# EAGLE design MiSTer Vector 2.0 (EAGLE 9.0.1)
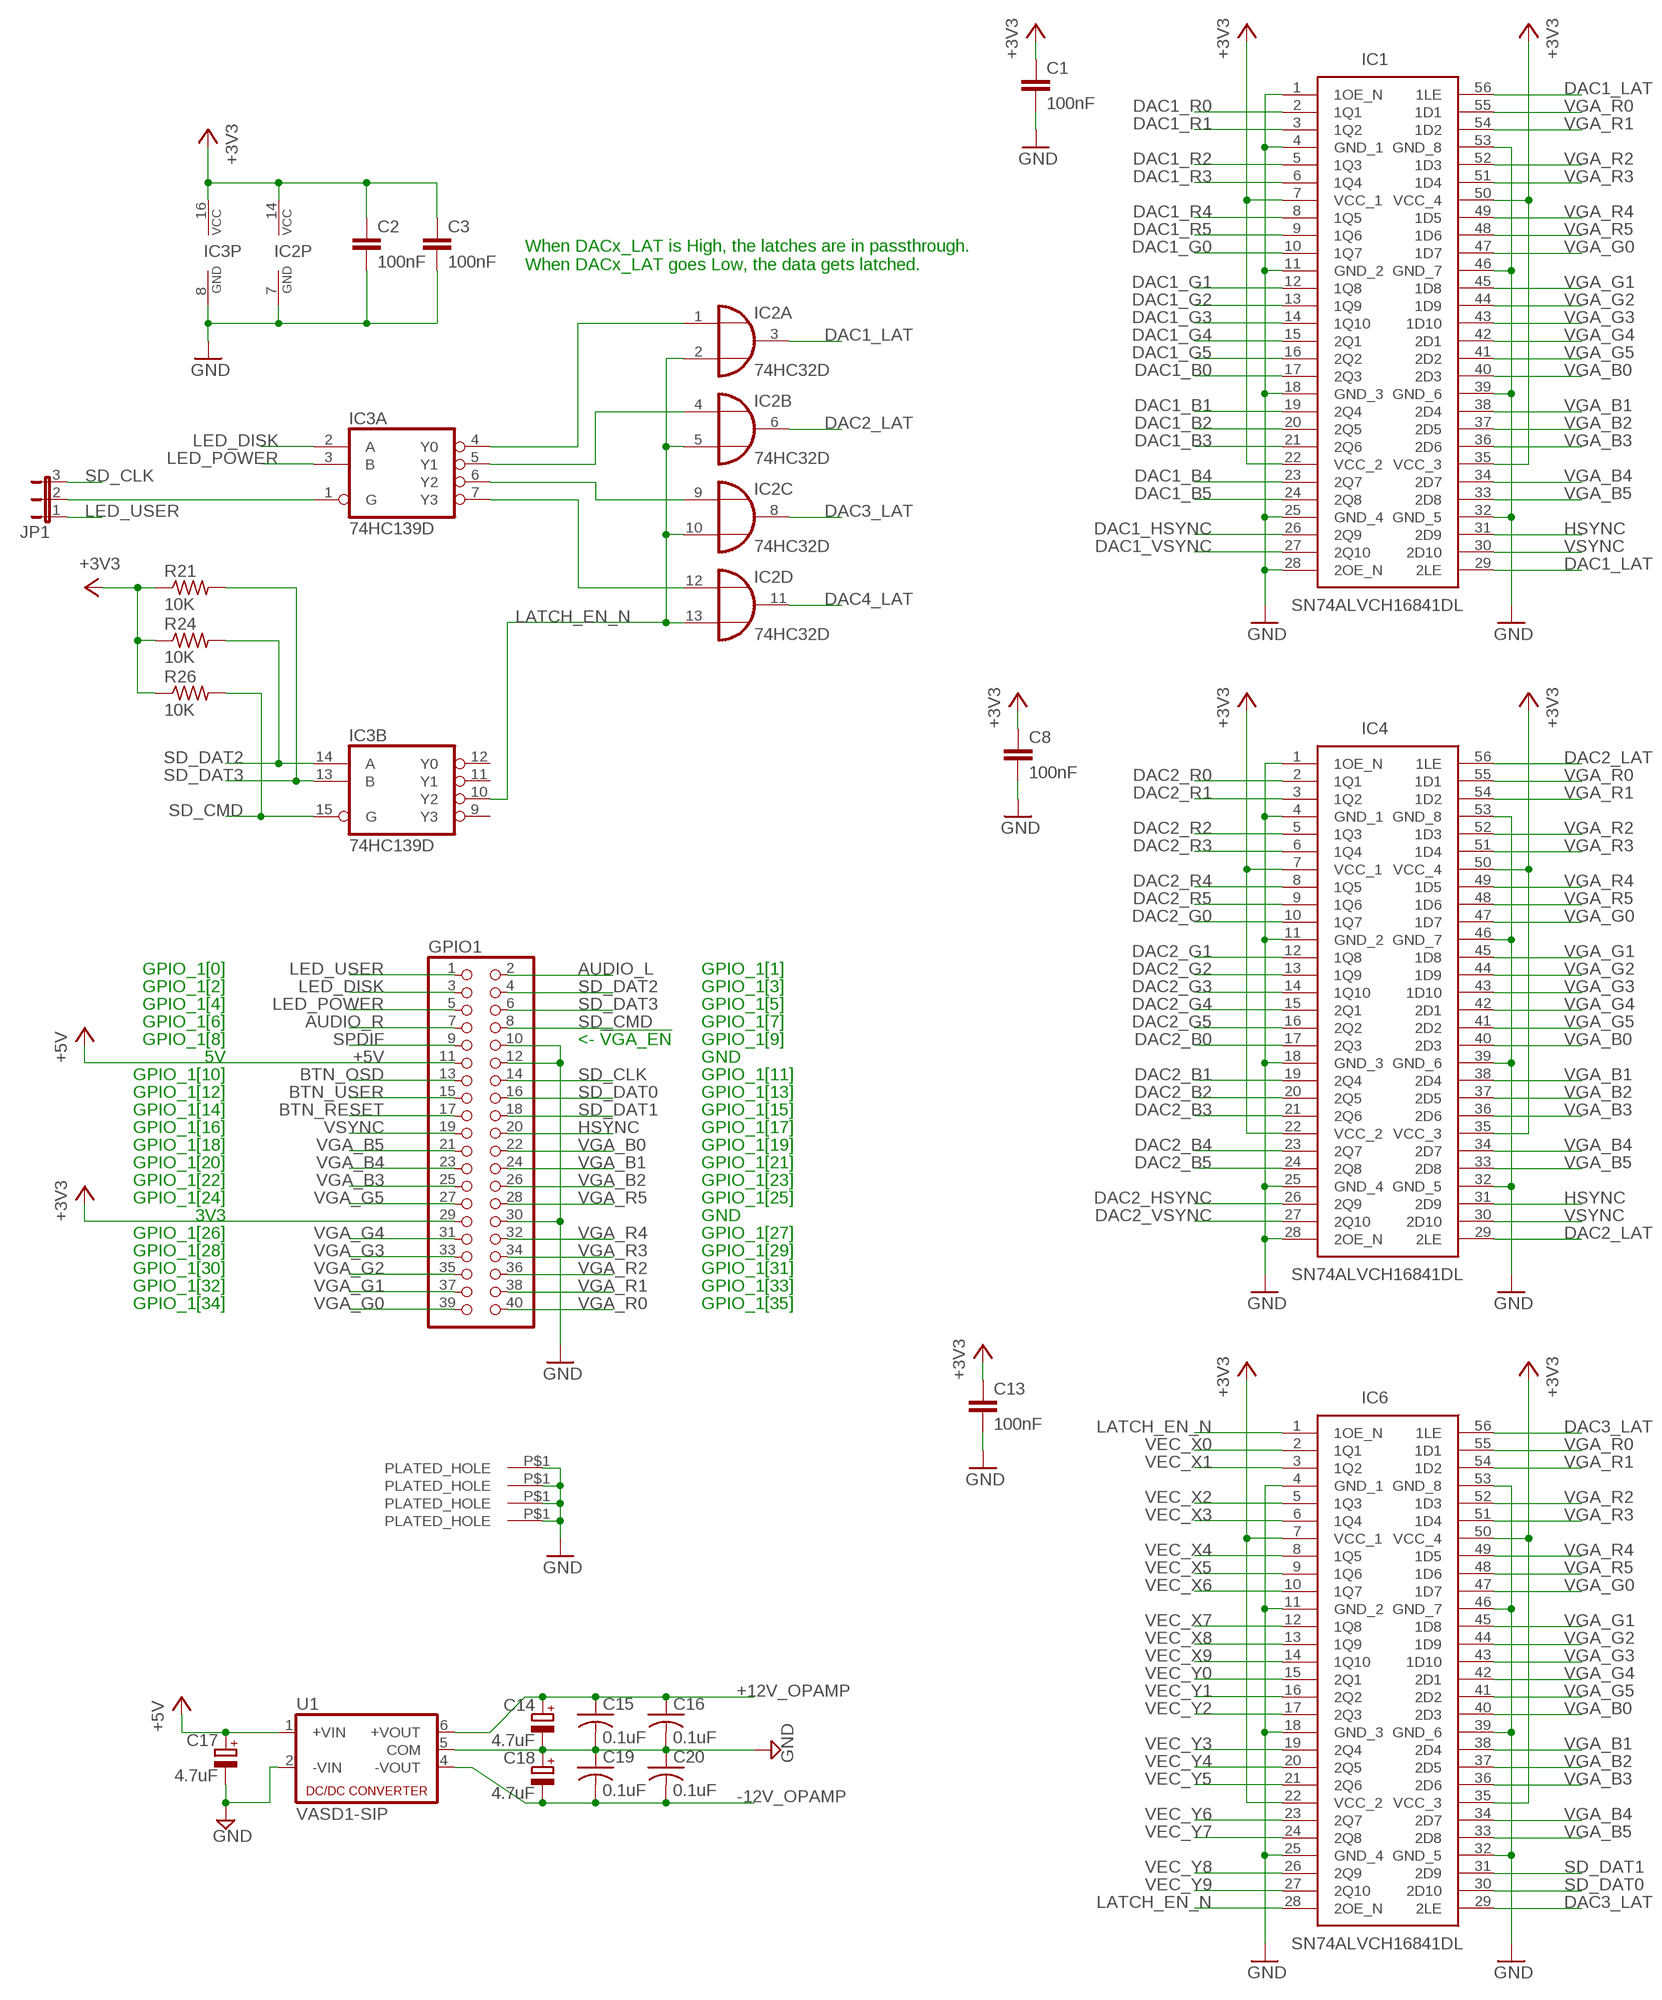
[diagram p0: schematic, sheet 1, part 1 of 2]
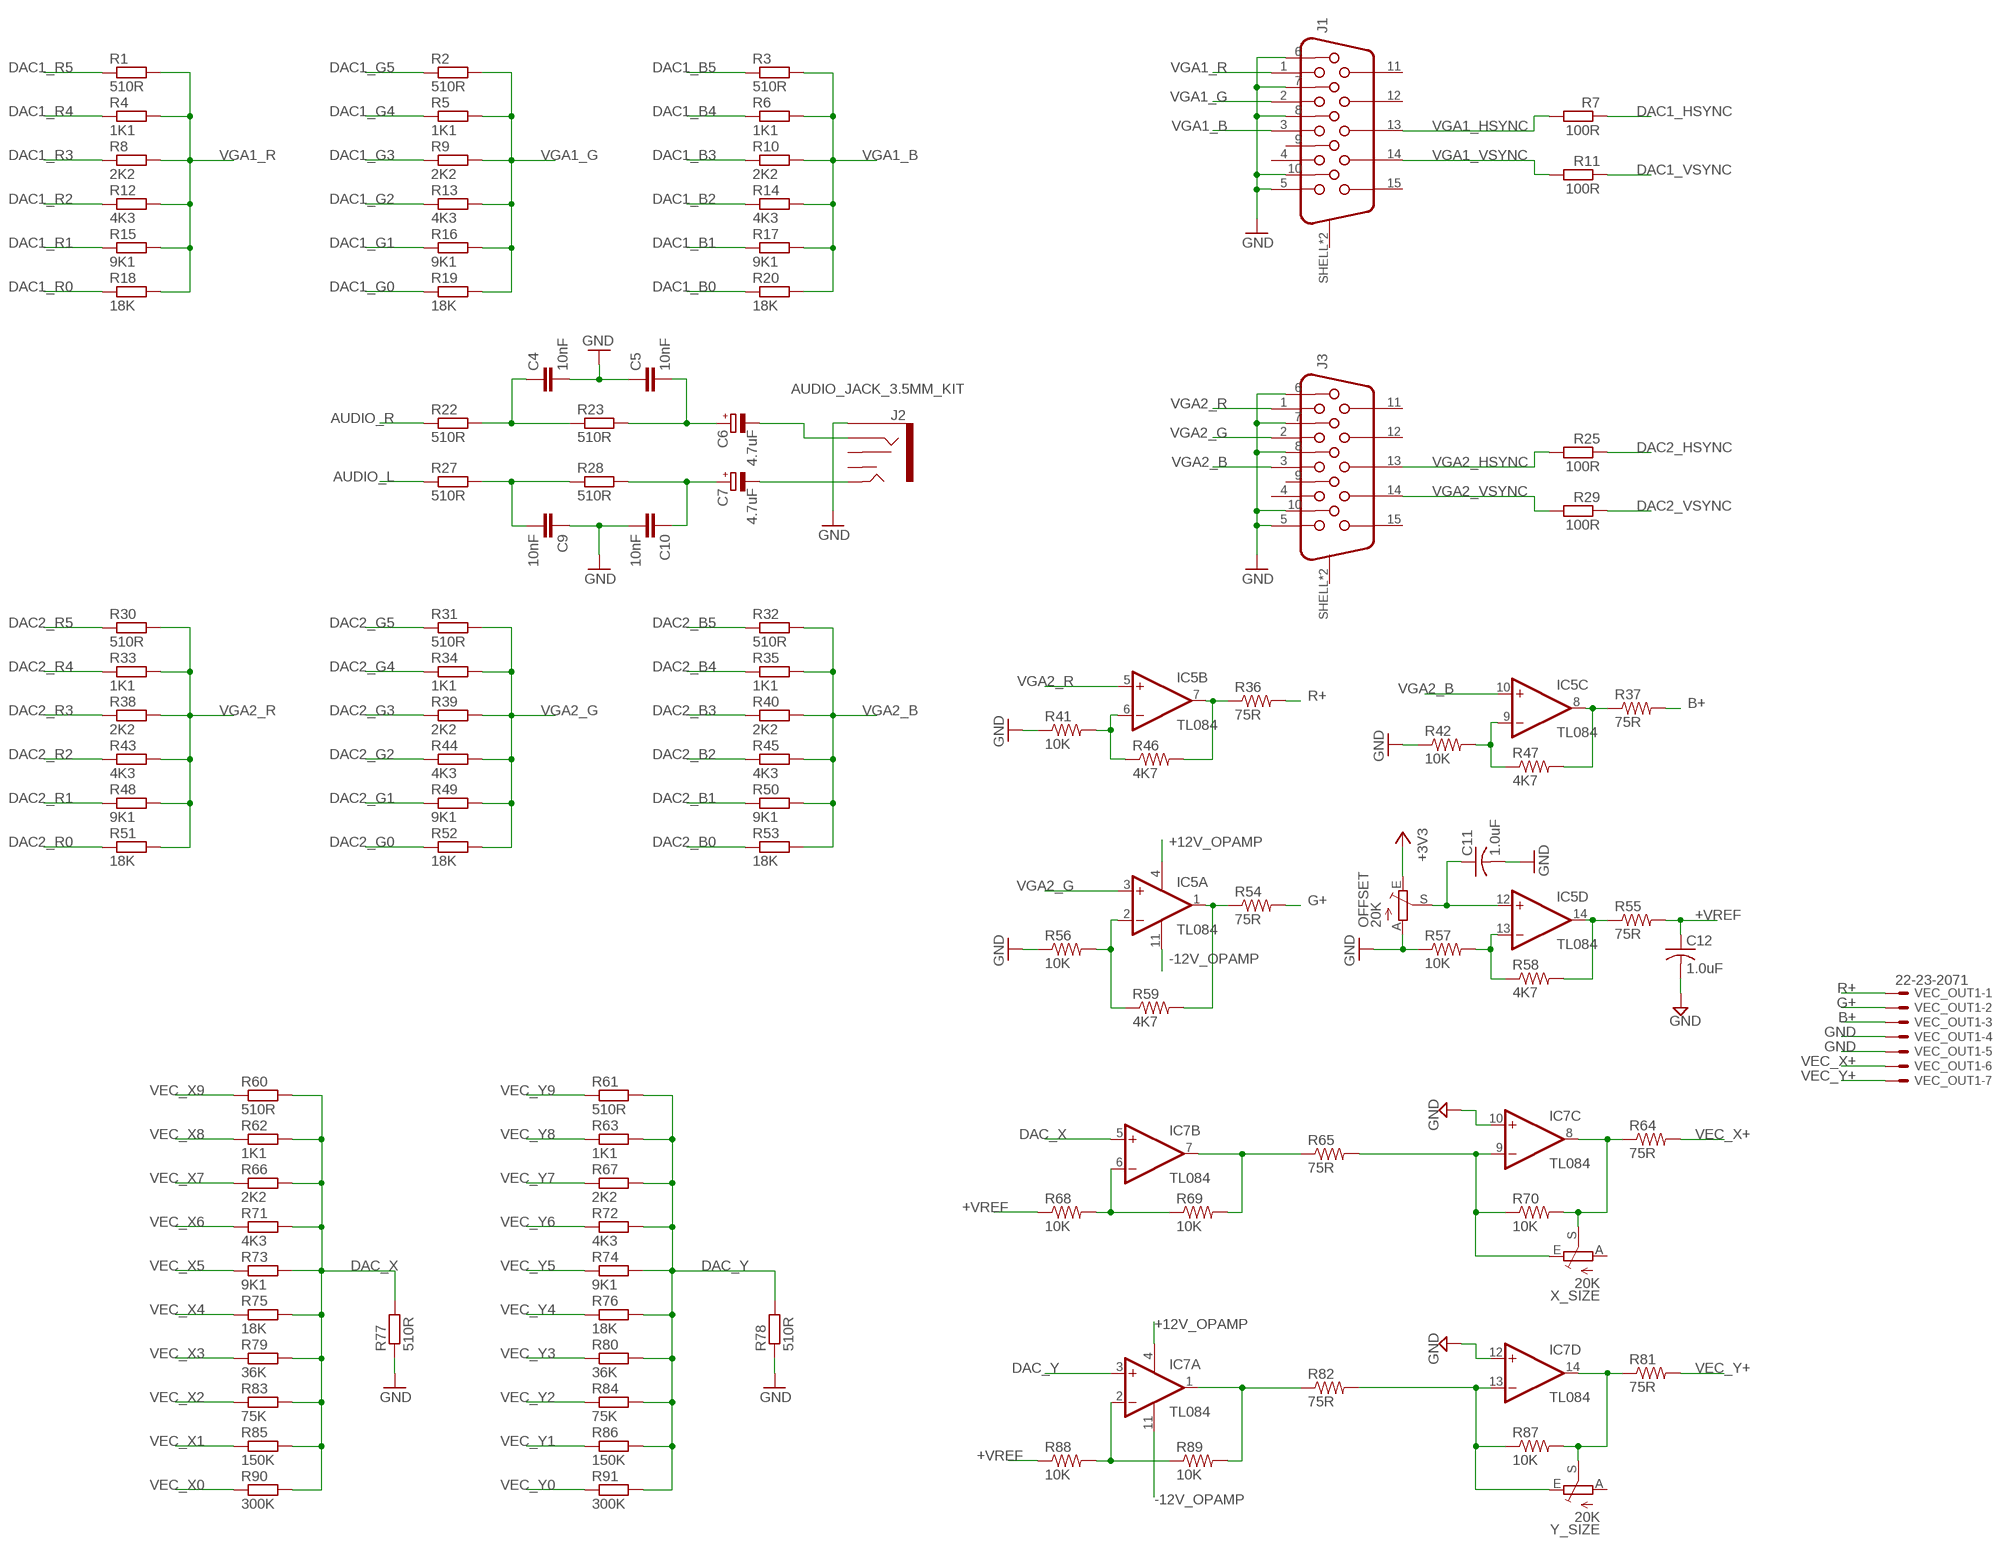
[diagram p1: schematic, sheet 1, part 2 of 2]

## Parts
C1  100nF  C-EUC0603  [C0603]
C2  100nF  C-EUC0603  [C0603]
C3  100nF  C-EUC0603  [C0603]
C4  10nF  C-EUC0603  [C0603]
C5  10nF  C-EUC0603  [C0603]
C6  4.7uF  CPOL-EUCT3528  [CT3528]
C7  4.7uF  CPOL-EUCT3528  [CT3528]
C8  100nF  C-EUC0603  [C0603]
C9  10nF  C-EUC0603  [C0603]
C10  10nF  C-EUC0603  [C0603]
C11  1.0uF  C-USC0603  [C0603]
C12  1.0uF  C-USC0603  [C0603]
C13  100nF  C-EUC0603  [C0603]
C14  4.7uF  CPOL-EUCT3528  [CT3528]
C15  0.1uF  C-USC0603  [C0603]
C16  0.1uF  C-USC0603  [C0603]
C17  4.7uF  CPOL-EUCT3528  [CT3528]
C18  4.7uF  CPOL-EUCT3528  [CT3528]
C19  0.1uF  C-USC0603  [C0603]
C20  0.1uF  C-USC0603  [C0603]
GPIO1  PINHD-2X20  [2X20]
IC1  SN74ALVCH16841DL  [SOP50P810X120-56N]
IC2  74HC32D  [SO14]
IC3  74HC139D  [SO16]
IC4  SN74ALVCH16841DL  [SOP50P810X120-56N]
IC5  TL084  [SOIC-14]
IC6  SN74ALVCH16841DL  [SOP50P810X120-56N]
IC7  TL084  [SOIC-14]
J1  618015330923  [618015330923]
J2  AUDIO_JACK_3.5MM_KIT  [AUDIO-JACK-KIT]
J3  618015330923  [618015330923]
JP1  JP2E  [JP2]
OFFSET  20K  TRIM_EU-B25P  [B25P]
R1  510R  R-EU_R0603  [R0603]
R2  510R  R-EU_R0603  [R0603]
R3  510R  R-EU_R0603  [R0603]
R4  1K1  R-EU_R0603  [R0603]
R5  1K1  R-EU_R0603  [R0603]
R6  1K1  R-EU_R0603  [R0603]
R7  100R  R-EU_R0603  [R0603]
R8  2K2  R-EU_R0603  [R0603]
R9  2K2  R-EU_R0603  [R0603]
R10  2K2  R-EU_R0603  [R0603]
R11  100R  R-EU_R0603  [R0603]
R12  4K3  R-EU_R0603  [R0603]
R13  4K3  R-EU_R0603  [R0603]
R14  4K3  R-EU_R0603  [R0603]
R15  9K1  R-EU_R0603  [R0603]
R16  9K1  R-EU_R0603  [R0603]
R17  9K1  R-EU_R0603  [R0603]
R18  18K  R-EU_R0603  [R0603]
R19  18K  R-EU_R0603  [R0603]
R20  18K  R-EU_R0603  [R0603]
R21  10K  R-US_R0603  [R0603]
R22  510R  R-EU_R0603  [R0603]
R23  510R  R-EU_R0603  [R0603]
R24  10K  R-US_R0603  [R0603]
R25  100R  R-EU_R0603  [R0603]
R26  10K  R-US_R0603  [R0603]
R27  510R  R-EU_R0603  [R0603]
R28  510R  R-EU_R0603  [R0603]
R29  100R  R-EU_R0603  [R0603]
R30  510R  R-EU_R0603  [R0603]
R31  510R  R-EU_R0603  [R0603]
R32  510R  R-EU_R0603  [R0603]
R33  1K1  R-EU_R0603  [R0603]
R34  1K1  R-EU_R0603  [R0603]
R35  1K1  R-EU_R0603  [R0603]
R36  75R  R-US_R0603  [R0603]
R37  75R  R-US_R0603  [R0603]
R38  2K2  R-EU_R0603  [R0603]
R39  2K2  R-EU_R0603  [R0603]
R40  2K2  R-EU_R0603  [R0603]
R41  10K  R-US_R0603  [R0603]
R42  10K  R-US_R0603  [R0603]
R43  4K3  R-EU_R0603  [R0603]
R44  4K3  R-EU_R0603  [R0603]
R45  4K3  R-EU_R0603  [R0603]
R46  4K7  R-US_R0603  [R0603]
R47  4K7  R-US_R0603  [R0603]
R48  9K1  R-EU_R0603  [R0603]
R49  9K1  R-EU_R0603  [R0603]
R50  9K1  R-EU_R0603  [R0603]
R51  18K  R-EU_R0603  [R0603]
R52  18K  R-EU_R0603  [R0603]
R53  18K  R-EU_R0603  [R0603]
R54  75R  R-US_R0603  [R0603]
R55  75R  R-US_R0603  [R0603]
R56  10K  R-US_R0603  [R0603]
R57  10K  R-US_R0603  [R0603]
R58  4K7  R-US_R0603  [R0603]
R59  4K7  R-US_R0603  [R0603]
R60  510R  R-EU_R0603  [R0603]
R61  510R  R-EU_R0603  [R0603]
R62  1K1  R-EU_R0603  [R0603]
R63  1K1  R-EU_R0603  [R0603]
R64  75R  R-US_R0603  [R0603]
R65  75R  R-US_R0603  [R0603]
R66  2K2  R-EU_R0603  [R0603]
R67  2K2  R-EU_R0603  [R0603]
R68  10K  R-US_R0603  [R0603]
R69  10K  R-US_R0603  [R0603]
R70  10K  R-US_R0603  [R0603]
R71  4K3  R-EU_R0603  [R0603]
R72  4K3  R-EU_R0603  [R0603]
R73  9K1  R-EU_R0603  [R0603]
R74  9K1  R-EU_R0603  [R0603]
R75  18K  R-EU_R0603  [R0603]
R76  18K  R-EU_R0603  [R0603]
R77  510R  R-EU_R0603  [R0603]
R78  510R  R-EU_R0603  [R0603]
R79  36K  R-EU_R0603  [R0603]
R80  36K  R-EU_R0603  [R0603]
R81  75R  R-US_R0603  [R0603]
R82  75R  R-US_R0603  [R0603]
R83  75K  R-EU_R0603  [R0603]
R84  75K  R-EU_R0603  [R0603]
R85  150K  R-EU_R0603  [R0603]
R86  150K  R-EU_R0603  [R0603]
R87  10K  R-US_R0603  [R0603]
R88  10K  R-US_R0603  [R0603]
R89  10K  R-US_R0603  [R0603]
R90  300K  R-EU_R0603  [R0603]
R91  300K  R-EU_R0603  [R0603]
U1  VASD1-SIP  NMA  [NMA]
U$1  PLATED_HOLE3.6MM  [PLATED_HOLE_3.6MM]
U$2  PLATED_HOLE3.6MM  [PLATED_HOLE_3.6MM]
U$3  PLATED_HOLE3.6MM  [PLATED_HOLE_3.6MM]
U$4  PLATED_HOLE3.6MM  [PLATED_HOLE_3.6MM]
VEC_OUT1  22-23-2071  [22-23-2071]
X_SIZE  20K  TRIM_EU-B25P  [B25P]
Y_SIZE  20K  TRIM_EU-B25P  [B25P]

## Nets
+3V3: C1.1 C2.1 C3.1 C8.1 C13.1 GPIO1.29 IC1.7(VCC_1) IC1.22(VCC_2) IC1.35(VCC_3) IC1.50(VCC_4) IC2.14(P:VCC) IC3.16(P:VCC) IC4.7(VCC_1) IC4.22(VCC_2) IC4.35(VCC_3) IC4.50(VCC_4) IC6.7(VCC_1) IC6.22(VCC_2) IC6.35(VCC_3) IC6.50(VCC_4) OFFSET.E R21.1 R24.1 R26.1
+5V: C17.+ GPIO1.11 U1.1(+VIN)
+12V_OPAMP: C14.+ C15.1 C16.1 IC5.4(A:V+) IC7.4(A:V+) U1.6(+VOUT)
+VREF: C12.1 R55.2 R68.1 R88.1
-12V_OPAMP: C18.- C19.2 C20.2 IC5.11(A:V-) IC7.11(A:V-) U1.4(-VOUT)
AUDIO_L: GPIO1.2 R27.1
AUDIO_R: GPIO1.7 R22.1
B1+: IC5.8(C:OUT) R37.1 R47.2
B+: R37.2 VEC_OUT1.3
BTN_OSD: GPIO1.13
BTN_RESET: GPIO1.17
BTN_USER: GPIO1.15
DAC1_B0: IC1.17(2Q3) R20.1
DAC1_B1: IC1.19(2Q4) R17.1
DAC1_B2: IC1.20(2Q5) R14.1
DAC1_B3: IC1.21(2Q6) R10.1
DAC1_B4: IC1.23(2Q7) R6.1
DAC1_B5: IC1.24(2Q8) R3.1
DAC1_G0: IC1.10(1Q7) R19.1
DAC1_G1: IC1.12(1Q8) R16.1
DAC1_G2: IC1.13(1Q9) R13.1
DAC1_G3: IC1.14(1Q10) R9.1
DAC1_G4: IC1.15(2Q1) R5.1
DAC1_G5: IC1.16(2Q2) R2.1
DAC1_HSYNC: IC1.26(2Q9) R7.1
DAC1_LAT: IC1.29(2LE) IC1.56(1LE) IC2.3(A:O)
DAC1_R0: IC1.2(1Q1) R18.1
DAC1_R1: IC1.3(1Q2) R15.1
DAC1_R2: IC1.5(1Q3) R12.1
DAC1_R3: IC1.6(1Q4) R8.1
DAC1_R4: IC1.8(1Q5) R4.1
DAC1_R5: IC1.9(1Q6) R1.1
DAC1_VSYNC: IC1.27(2Q10) R11.1
DAC2_B0: IC4.17(2Q3) R53.1
DAC2_B1: IC4.19(2Q4) R50.1
DAC2_B2: IC4.20(2Q5) R45.1
DAC2_B3: IC4.21(2Q6) R40.1
DAC2_B4: IC4.23(2Q7) R35.1
DAC2_B5: IC4.24(2Q8) R32.1
DAC2_G0: IC4.10(1Q7) R52.1
DAC2_G1: IC4.12(1Q8) R49.1
DAC2_G2: IC4.13(1Q9) R44.1
DAC2_G3: IC4.14(1Q10) R39.1
DAC2_G4: IC4.15(2Q1) R34.1
DAC2_G5: IC4.16(2Q2) R31.1
DAC2_HSYNC: IC4.26(2Q9) R25.1
DAC2_LAT: IC2.6(B:O) IC4.29(2LE) IC4.56(1LE)
DAC2_R0: IC4.2(1Q1) R51.1
DAC2_R1: IC4.3(1Q2) R48.1
DAC2_R2: IC4.5(1Q3) R43.1
DAC2_R3: IC4.6(1Q4) R38.1
DAC2_R4: IC4.8(1Q5) R33.1
DAC2_R5: IC4.9(1Q6) R30.1
DAC2_VSYNC: IC4.27(2Q10) R29.1
DAC3_LAT: IC2.8(C:O) IC6.29(2LE) IC6.56(1LE)
DAC4_LAT: IC2.11(D:O)
DAC_X: IC7.5(B:+IN) R60.2 R62.2 R66.2 R71.2 R73.2 R75.2 R77.2 R79.2 R83.2 R85.2 R90.2
DAC_Y: IC7.3(A:+IN) R61.2 R63.2 R67.2 R72.2 R74.2 R76.2 R78.2 R80.2 R84.2 R86.2 R91.2
G1+: IC5.1(A:OUT) R54.1 R59.2
G+: R54.2 VEC_OUT1.2
GND: C1.2 C2.2 C3.2 C4.2 C5.1 C8.2 C9.1 C10.2 C11.2 C12.2 C13.2 C14.- C15.2 C16.2 C17.- C18.+ C19.1 C20.1 GPIO1.10 GPIO1.12 GPIO1.30 IC1.1(1OE_N) IC1.4(GND_1) IC1.11(GND_2) IC1.18(GND_3) IC1.25(GND_4) IC1.28(2OE_N) IC1.32(GND_5) IC1.39(GND_6) IC1.46(GND_7) IC1.53(GND_8) IC2.7(P:GND) IC3.8(P:GND) IC4.1(1OE_N) IC4.4(GND_1) IC4.11(GND_2) IC4.18(GND_3) IC4.25(GND_4) IC4.28(2OE_N) IC4.32(GND_5) IC4.39(GND_6) IC4.46(GND_7) IC4.53(GND_8) IC6.4(GND_1) IC6.11(GND_2) IC6.18(GND_3) IC6.25(GND_4) IC6.32(GND_5) IC6.39(GND_6) IC6.46(GND_7) IC6.53(GND_8) IC7.10(C:+IN) IC7.12(D:+IN) J1.5 J1.6 J1.7 J1.8 J1.10 J2.SLEEVE J3.5 J3.6 J3.7 J3.8 J3.10 OFFSET.A R41.1 R42.1 R56.1 R57.1 R77.1 R78.1 U1.2(-VIN) U1.5(COM) U$1.P$1(PLATED_HOLE) U$2.P$1(PLATED_HOLE) U$3.P$1(PLATED_HOLE) U$4.P$1(PLATED_HOLE) VEC_OUT1.4 VEC_OUT1.5
HSYNC: GPIO1.20 IC1.31(2D9) IC4.31(2D9)
I1+: IC5.14(D:OUT) R55.1 R58.2
LATCH_EN_N: IC2.2(A:I1) IC2.5(B:I1) IC2.10(C:I1) IC2.13(D:I1) IC3.10(B:Y2) IC6.1(1OE_N) IC6.28(2OE_N)
LED_DISK: GPIO1.3 IC3.2(A:A)
LED_POWER: GPIO1.5 IC3.3(A:B)
LED_USER: GPIO1.1 JP1.1
N$4: C11.1 IC5.12(D:+IN) OFFSET.S
N$5: IC3.1(A:G) JP1.2
N$6: C6.- J2.RING
N$7: C9.2 R27.2 R28.1
N$8: C7.+ C10.1 R28.2
N$9: C7.- J2.TIP
N$10: C4.1 R22.2 R23.1
N$11: C5.2 C6.+ R23.2
N$32: IC2.1(A:I0) IC3.4(A:Y0)
N$33: IC2.4(B:I0) IC3.5(A:Y1)
N$40: IC2.9(C:I0) IC3.6(A:Y2)
N$41: IC2.12(D:I0) IC3.7(A:Y3)
N$51: IC7.6(B:-IN) R68.2 R69.1
N$52: IC7.2(A:-IN) R88.2 R89.1
N$54: IC7.7(B:OUT) R65.1 R69.2
N$55: IC7.9(C:-IN) R65.2 R70.1 X_SIZE.E
N$57: IC7.13(D:-IN) R82.2 R87.1 Y_SIZE.E
N$58: IC7.14(D:OUT) R81.1 R87.2 Y_SIZE.S
N$59: IC7.8(C:OUT) R64.1 R70.2 X_SIZE.S
N$60: IC7.1(A:OUT) R82.1 R89.2
N$61: IC5.2(A:-IN) R56.2 R59.1
N$62: IC5.6(B:-IN) R41.2 R46.1
N$63: IC5.13(D:-IN) R57.2 R58.1
N$64: IC5.9(C:-IN) R42.2 R47.1
R1+: IC5.7(B:OUT) R36.1 R46.2
R+: R36.2 VEC_OUT1.1
SD_CLK: GPIO1.14 JP1.3
SD_CMD: GPIO1.8 IC3.15(B:G) R26.2
SD_DAT0: GPIO1.16 IC6.30(2D10)
SD_DAT1: GPIO1.18 IC6.31(2D9)
SD_DAT2: GPIO1.4 IC3.14(B:A) R24.2
SD_DAT3: GPIO1.6 IC3.13(B:B) R21.2
SPDIF: GPIO1.9
VEC_X0: IC6.2(1Q1) R90.1
VEC_X1: IC6.3(1Q2) R85.1
VEC_X2: IC6.5(1Q3) R83.1
VEC_X3: IC6.6(1Q4) R79.1
VEC_X4: IC6.8(1Q5) R75.1
VEC_X5: IC6.9(1Q6) R73.1
VEC_X6: IC6.10(1Q7) R71.1
VEC_X7: IC6.12(1Q8) R66.1
VEC_X8: IC6.13(1Q9) R62.1
VEC_X9: IC6.14(1Q10) R60.1
VEC_X+: R64.2 VEC_OUT1.6
VEC_Y0: IC6.15(2Q1) R91.1
VEC_Y1: IC6.16(2Q2) R86.1
VEC_Y2: IC6.17(2Q3) R84.1
VEC_Y3: IC6.19(2Q4) R80.1
VEC_Y4: IC6.20(2Q5) R76.1
VEC_Y5: IC6.21(2Q6) R74.1
VEC_Y6: IC6.23(2Q7) R72.1
VEC_Y7: IC6.24(2Q8) R67.1
VEC_Y8: IC6.26(2Q9) R63.1
VEC_Y9: IC6.27(2Q10) R61.1
VEC_Y+: R81.2 VEC_OUT1.7
VGA1_B: J1.3 R3.2 R6.2 R10.2 R14.2 R17.2 R20.2
VGA1_G: J1.2 R2.2 R5.2 R9.2 R13.2 R16.2 R19.2
VGA1_HSYNC: J1.13 R7.2
VGA1_R: J1.1 R1.2 R4.2 R8.2 R12.2 R15.2 R18.2
VGA1_VSYNC: J1.14 R11.2
VGA2_B: IC5.10(C:+IN) J3.3 R32.2 R35.2 R40.2 R45.2 R50.2 R53.2
VGA2_G: IC5.3(A:+IN) J3.2 R31.2 R34.2 R39.2 R44.2 R49.2 R52.2
VGA2_HSYNC: J3.13 R25.2
VGA2_R: IC5.5(B:+IN) J3.1 R30.2 R33.2 R38.2 R43.2 R48.2 R51.2
VGA2_VSYNC: J3.14 R29.2
VGA_B0: GPIO1.22 IC1.40(2D3) IC4.40(2D3) IC6.40(2D3)
VGA_B1: GPIO1.24 IC1.38(2D4) IC4.38(2D4) IC6.38(2D4)
VGA_B2: GPIO1.26 IC1.37(2D5) IC4.37(2D5) IC6.37(2D5)
VGA_B3: GPIO1.25 IC1.36(2D6) IC4.36(2D6) IC6.36(2D6)
VGA_B4: GPIO1.23 IC1.34(2D7) IC4.34(2D7) IC6.34(2D7)
VGA_B5: GPIO1.21 IC1.33(2D8) IC4.33(2D8) IC6.33(2D8)
VGA_G0: GPIO1.39 IC1.47(1D7) IC4.47(1D7) IC6.47(1D7)
VGA_G1: GPIO1.37 IC1.45(1D8) IC4.45(1D8) IC6.45(1D8)
VGA_G2: GPIO1.35 IC1.44(1D9) IC4.44(1D9) IC6.44(1D9)
VGA_G3: GPIO1.33 IC1.43(1D10) IC4.43(1D10) IC6.43(1D10)
VGA_G4: GPIO1.31 IC1.42(2D1) IC4.42(2D1) IC6.42(2D1)
VGA_G5: GPIO1.27 IC1.41(2D2) IC4.41(2D2) IC6.41(2D2)
VGA_R0: GPIO1.40 IC1.55(1D1) IC4.55(1D1) IC6.55(1D1)
VGA_R1: GPIO1.38 IC1.54(1D2) IC4.54(1D2) IC6.54(1D2)
VGA_R2: GPIO1.36 IC1.52(1D3) IC4.52(1D3) IC6.52(1D3)
VGA_R3: GPIO1.34 IC1.51(1D4) IC4.51(1D4) IC6.51(1D4)
VGA_R4: GPIO1.32 IC1.49(1D5) IC4.49(1D5) IC6.49(1D5)
VGA_R5: GPIO1.28 IC1.48(1D6) IC4.48(1D6) IC6.48(1D6)
VSYNC: GPIO1.19 IC1.30(2D10) IC4.30(2D10)
Unconnected: IC3.9(B:Y3) IC3.11(B:Y1) IC3.12(B:Y0) J1.4 J1.9 J1.11 J1.12 J1.15 J1.SHELL1(SHIELD) J1.SHELL(SHIELD) J2.RSH J2.TSH J3.4 J3.9 J3.11 J3.12 J3.15 J3.SHELL1(SHIELD) J3.SHELL(SHIELD) X_SIZE.A Y_SIZE.A

## Notes on the sheet
- When DACx_LAT is High, the latches are in passthrough.
  When DACx_LAT goes Low, the data gets latched.
- GPIO_1[0] | GPIO_1[1]
- GPIO_1[2] | GPIO_1[3]
- GPIO_1[4] | GPIO_1[5]
- GPIO_1[6] | GPIO_1[7]
- GPIO_1[8] | <- !VGA_EN | GPIO_1[9]
- 5V | GND
- GPIO_1[10] | GPIO_1[11]
- GPIO_1[12] | GPIO_1[13]
- GPIO_1[14] | GPIO_1[15]
- GPIO_1[16] | GPIO_1[17]
- GPIO_1[18] | GPIO_1[19]
- GPIO_1[20] | GPIO_1[21]
- GPIO_1[22] | GPIO_1[23]
- GPIO_1[24] | GPIO_1[25]
- 3V3 | GND
- GPIO_1[26] | GPIO_1[27]
- GPIO_1[28] | GPIO_1[29]
- GPIO_1[30] | GPIO_1[31]
- GPIO_1[32] | GPIO_1[33]
- GPIO_1[34] | GPIO_1[35]

## Library data of the parts
C1-C5 C8-C10 C13 = rcl:C-EU: CAPACITOR, European symbol
C6 C7 C14 C17 C18 = rcl:CPOL-EU: POLARIZED CAPACITOR, European symbol
C11 C12 C15 C16 C19 C20 = adafruit:C-US: CAPACITOR, American symbol
GPIO1 = pinhead:PINHD-2X20: PIN HEADER
IC1 IC4 IC6 = SN74ALVCH16841DL:SN74ALVCH16841DL: 20-Bit Bus-Interface D-Type Latch With 3-State Outputs Source: Datasheet <https://www.ti.com/lit/gpn/sn74alvch16841>; DESCRIPTION: 20-Bit Bus-Interface D-Type Latch With 3-State Outputs; HEIGHT: 1.2mm; MANUFACTURER_NAME: Texas Instruments; MANUFACTURER_PART_NUMBER: SN74ALVCH16841DL
IC2 = 74xx-eu:74*32: Quad 2-input OR gate
IC3 = 74xx-eu:74*139: Dual 2-line to 4-line DECODER/DEMULTIPLEXER
IC5 IC7 = favreau:TL084: Texas Instruments TL084 JFET General Purpose Op-Amp
J1 J3 = con-wurth:618015330923: WR-DSUB Female High Density Angled PCB Connector with Hex Screw, 15 Pins=>Code : Con_I-O_DSUB_PCB_Female_w-screw_618015330923 <http://katalog.we-online.de/media/images/eican/Con_I-O_DSUB_PCB_Female_w-screw_6180xx330923_pf2.jpg> Details see: http://katalog.we-online.de/en/em/DSUB_FEMALE_HIGH_DENSITY_ANGLED_PCB_CONNECTOR_W_HEX_SCREW_6180XX330923 Created 2014-07-10, Karrer Zheng 2014 (C) Würth Elektronik
J2 = SparkFun-Connectors:AUDIO_JACK_3.5MM: Audio Jack 3.5mm variants of PTH and SMT stereo audio jack with bypass switches. SparkFun Products: SparkFun SparkPunk Sound Kit <[https://www.sparkfun.com/products/11177]> - PTH MP3 Trigger <https://www.sparkfun.com/products/13720> -3.5mm SMD SparkFun PicoBoard <https://www.sparkfun.com/products/11888>- 2.5mm SMD; PROD_ID: CONN-08774; SF_ID: PRT-08032
JP1 = jumper:JP2E: JUMPER
OFFSET X_SIZE Y_SIZE = pot:TRIM_EU-: POTENTIOMETER
R1-R20 R22 R23 R25 R27-R35 R38-R40 R43-R45 R48-R53 R60-R63 R66 R67 R71-R80 R83-R86 R90 R91 = rcl:R-EU_: RESISTOR, European symbol
R21 R24 R26 R36 R37 R41 R42 R46 R47 R54-R59 R64 R65 R68-R70 R81 R82 R87-R89 = resistor:R-US_: RESISTOR, American symbol
U1 = dc-dc-converter:NMA: DC-DC CONVERTER; MF: C & D TECHNOLOGIES, INC; MPN: NMA0515SC; OC_FARNELL: 1021434; OC_NEWARK: 61K3064
U$1-U$4 = mounting_holes_vias:PLATED_HOLE
VEC_OUT1 = con-molex:22-23-2071: .100" (2.54mm) Center Header - 7 Pin; MF: MOLEX; MPN: 22-23-2071; OC_FARNELL: 1654534; OC_NEWARK: 56H0445

## Board
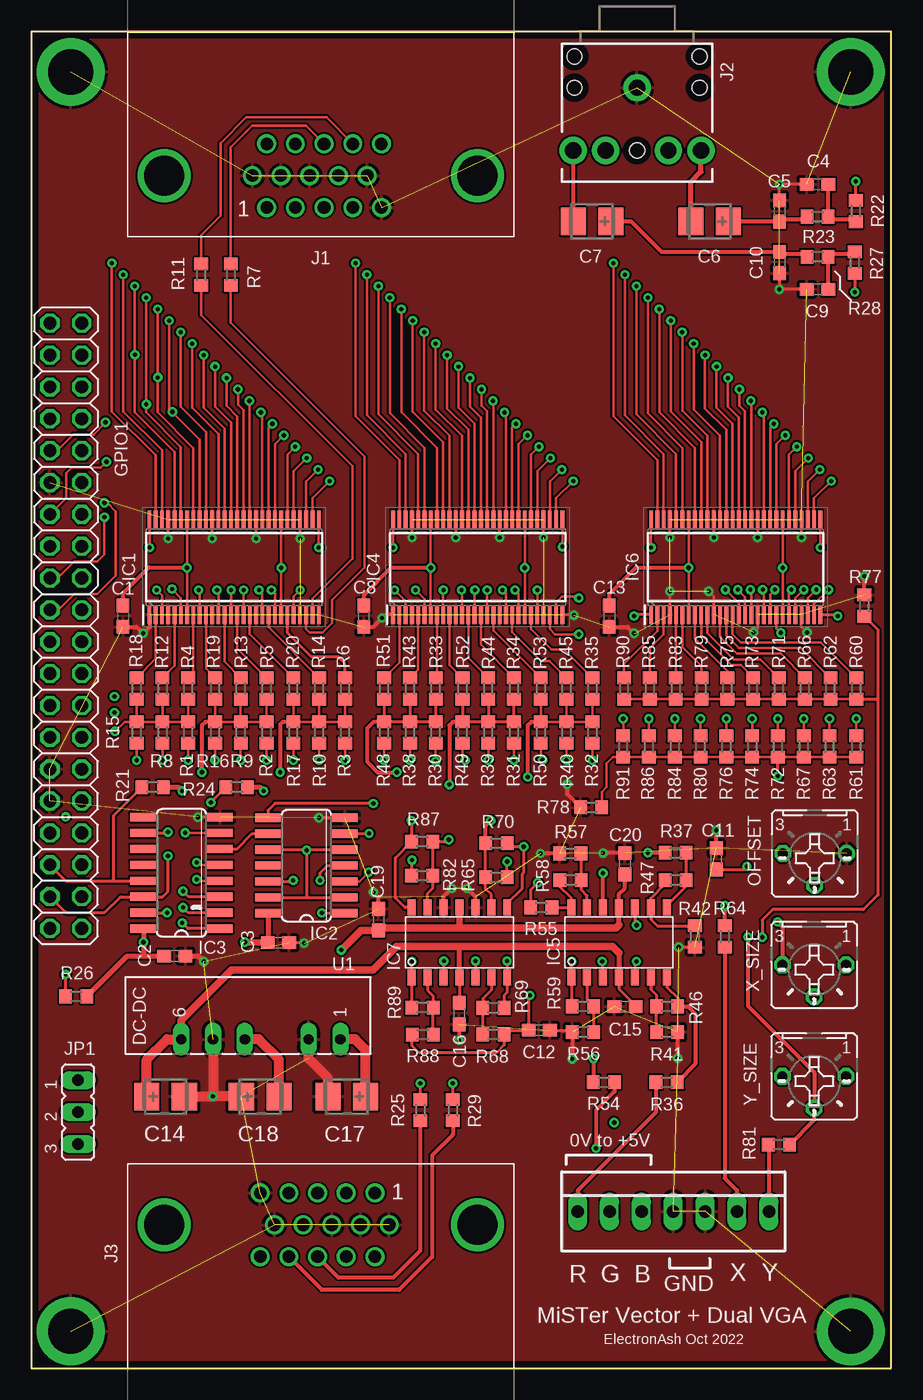
[diagram p2: board, top side]
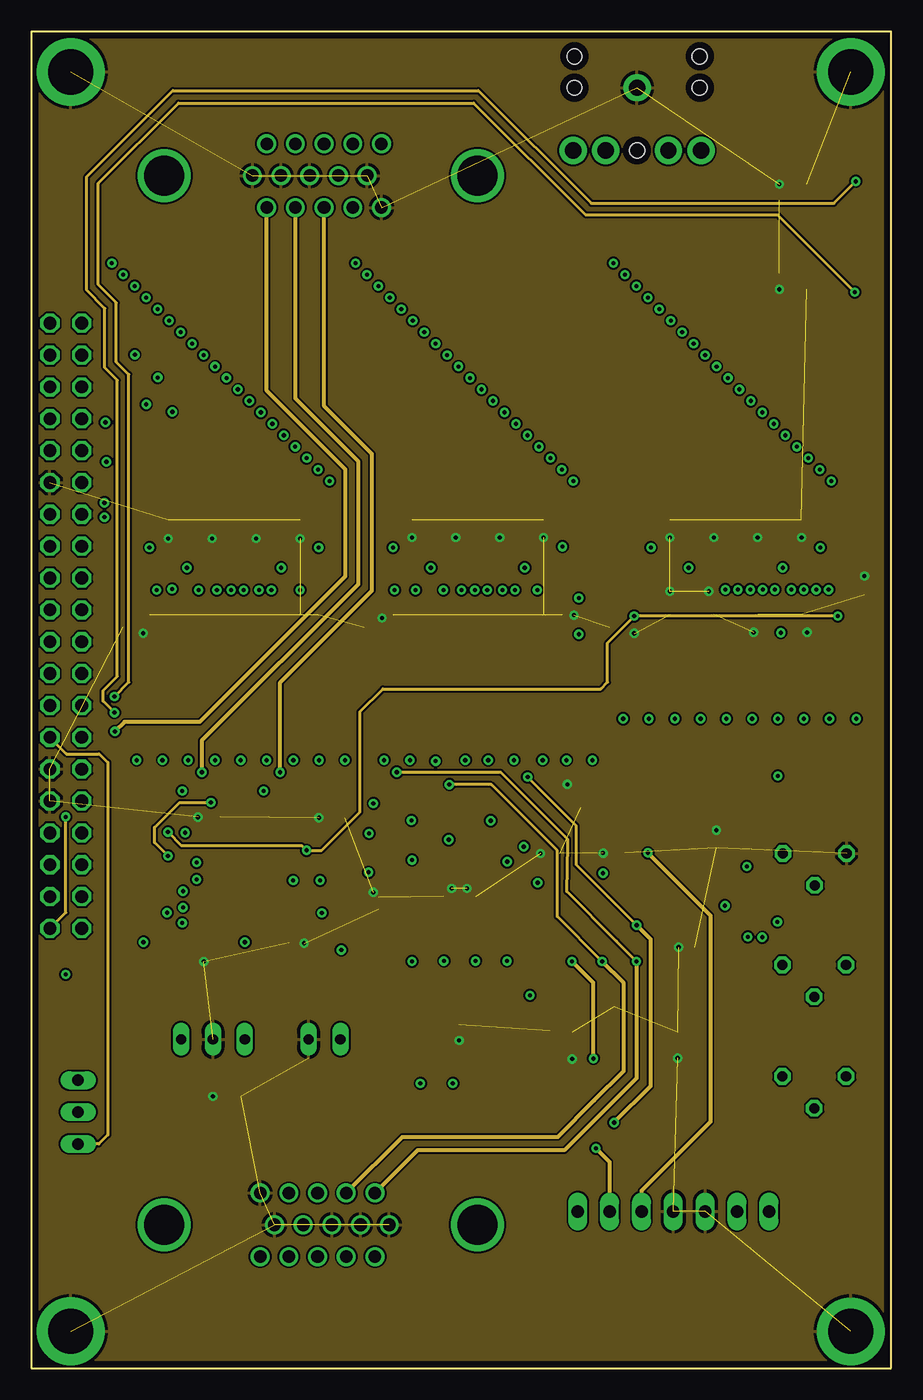
[diagram p3: board, inner layer InnerTopGND]
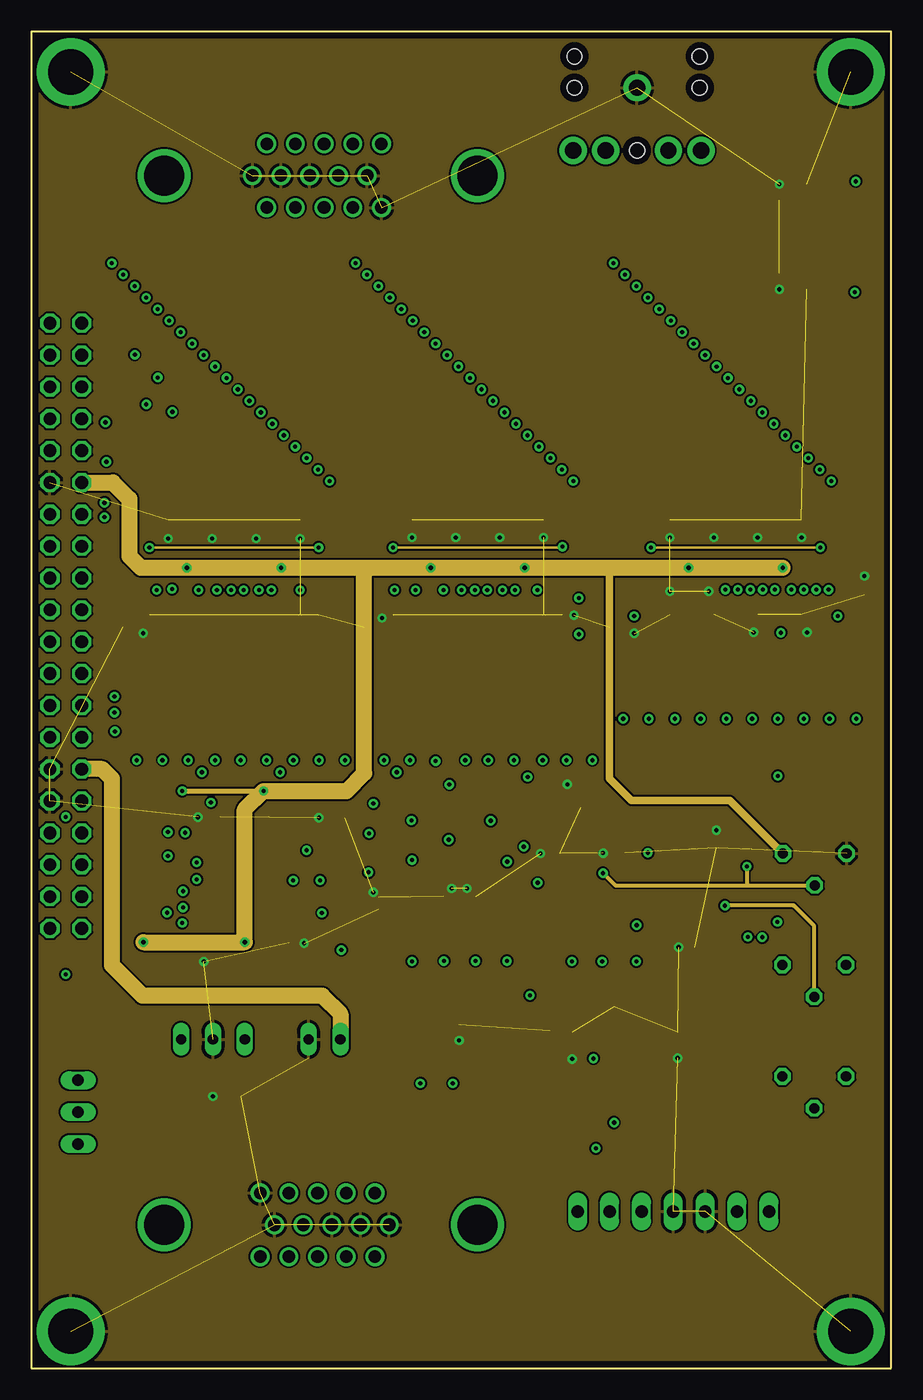
[diagram p4: board, inner layer InnerBottomPWR]
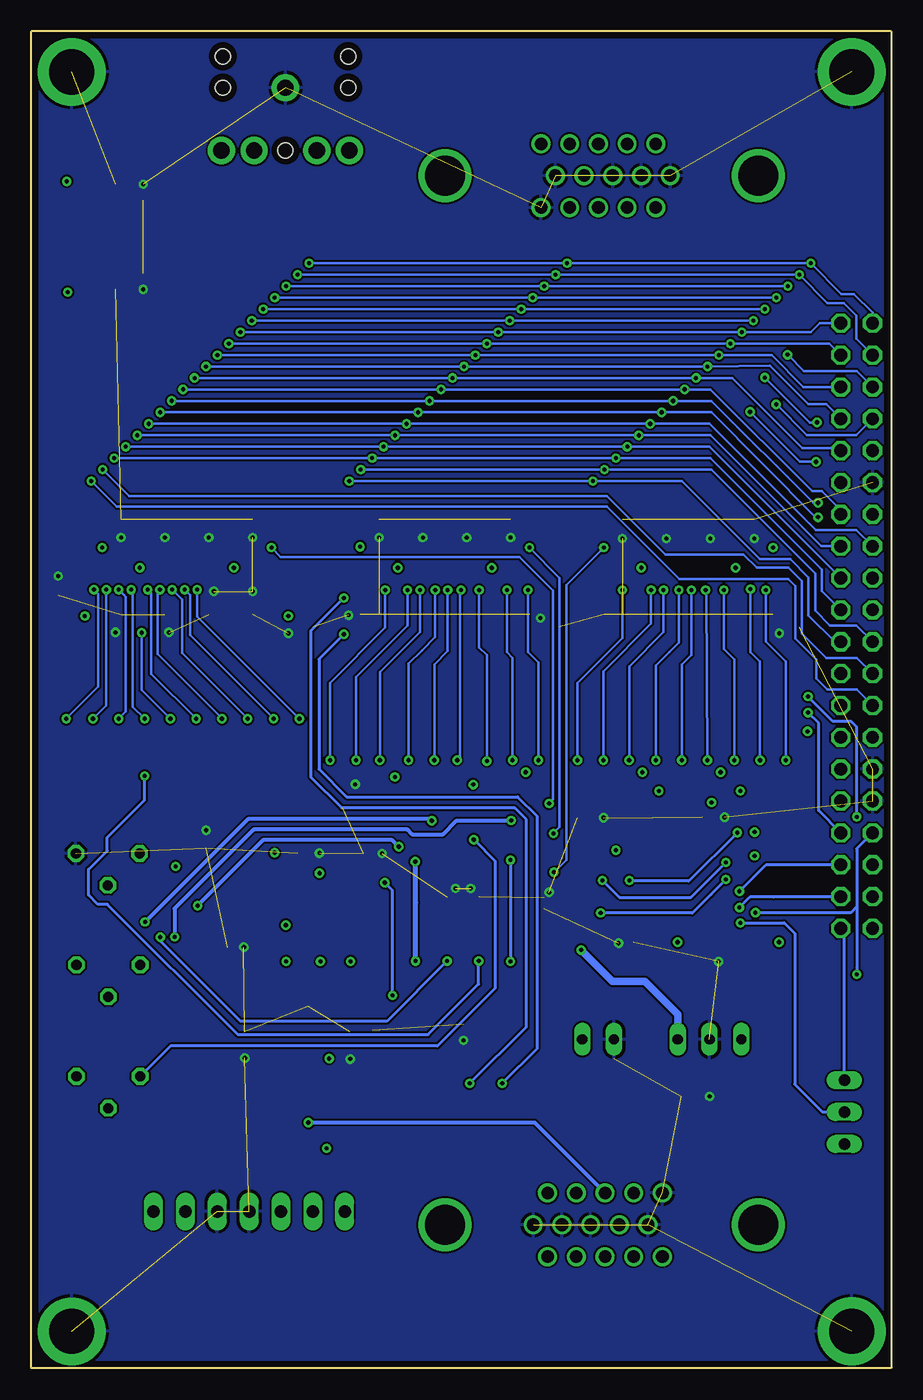
[diagram p5: board, bottom side, seen from below]

Size 68.58 x 106.6 mm. Coordinates in mm from the lower left corner, seen from the top.
Outline: 0,106.6 0,0 68.58,0 68.58,106.6 0,106.6
Copper layers (1*2*15*16): Top 0.035mm / dielectric 0.247mm / InnerTopGND 0.018mm / dielectric 1mm / InnerBottomPWR 0.018mm / dielectric 0.247mm / Bottom 0.035mm
Design rules "default *": minimum track width 6mil, minimum drill 13mil, track to track 6mil, track to pad 6mil, pad to pad 6mil, via to via 6mil, smd to smd 6mil, copper to edge 20mil, drill to drill 8mil, minimum pad ring 10mil, minimum via ring 8mil, stop-mask expansion 4mil, vias tented up to drill 20mil, thermal gap 10mil

### Footprints (pad centres in the part's own frame; a part is rotated, then mirrored left to right if it is on the bottom)
C0603 = smd 1.1 x 1: 1 -0.85,0; 2 0.85,0
CT3528 = smd 2 x 2.2: + -1.5,0; - 1.5,0
2X20 = drill 1.016 octagon: 1 -24.13,-1.27; 2 -24.13,1.27; 3 -21.59,-1.27; 4 -21.59,1.27; 5 -19.05,-1.27; 6 -19.05,1.27; 7 -16.51,-1.27; 8 -16.51,1.27; 9 -13.97,-1.27; 10 -13.97,1.27; 11 -11.43,-1.27; 12 -11.43,1.27; 13 -8.89,-1.27; 14 -8.89,1.27; 15 -6.35,-1.27; 16 -6.35,1.27; 17 -3.81,-1.27; 18 -3.81,1.27; 19 -1.27,-1.27; 20 -1.27,1.27; 21 1.27,-1.27; 22 1.27,1.27; 23 3.81,-1.27; 24 3.81,1.27; 25 6.35,-1.27; 26 6.35,1.27; 27 8.89,-1.27; 28 8.89,1.27; 29 11.43,-1.27; 30 11.43,1.27; 31 13.97,-1.27; 32 13.97,1.27; 33 16.51,-1.27; 34 16.51,1.27; 35 19.05,-1.27; 36 19.05,1.27; 37 21.59,-1.27; 38 21.59,1.27; 39 24.13,-1.27; 40 24.13,1.27
SOP50P810X120-56N = smd 1.475 x 0.3: 1 -3.788,6.75; 2 -3.788,6.25; 3 -3.788,5.75; 4 -3.788,5.25; 5 -3.788,4.75; 6 -3.788,4.25; 7 -3.788,3.75; 8 -3.788,3.25; 9 -3.788,2.75; 10 -3.788,2.25; 11 -3.788,1.75; 12 -3.788,1.25; 13 -3.788,0.75; 14 -3.788,0.25; 15 -3.788,-0.25; 16 -3.788,-0.75; 17 -3.788,-1.25; 18 -3.788,-1.75; 19 -3.788,-2.25; 20 -3.788,-2.75; 21 -3.788,-3.25; 22 -3.788,-3.75; 23 -3.788,-4.25; 24 -3.788,-4.75; 25 -3.788,-5.25; 26 -3.788,-5.75; 27 -3.788,-6.25; 28 -3.788,-6.75; 29 3.788,-6.75; 30 3.788,-6.25; 31 3.788,-5.75; 32 3.788,-5.25; 33 3.788,-4.75; 34 3.788,-4.25; 35 3.788,-3.75; 36 3.788,-3.25; 37 3.788,-2.75; 38 3.788,-2.25; 39 3.788,-1.75; 40 3.788,-1.25; 41 3.788,-0.75; 42 3.788,-0.25; 43 3.788,0.25; 44 3.788,0.75; 45 3.788,1.25; 46 3.788,1.75; 47 3.788,2.25; 48 3.788,2.75; 49 3.788,3.25; 50 3.788,3.75; 51 3.788,4.25; 52 3.788,4.75; 53 3.788,5.25; 54 3.788,5.75; 55 3.788,6.25; 56 3.788,6.75
SO14 = smd 0.66 x 2.032: 1 -3.81,-3.073; 2 -2.54,-3.073; 3 -1.27,-3.073; 4 0,-3.073; 5 1.27,-3.073; 6 2.54,-3.073; 7 3.81,-3.073; 8 3.81,3.073; 9 2.54,3.073; 10 1.27,3.073; 11 0,3.073; 12 -1.27,3.073; 13 -2.54,3.073; 14 -3.81,3.073
SO16 = smd 0.66 x 2.032: 1 -4.445,-3.073; 2 -3.175,-3.073; 3 -1.905,-3.073; 4 -0.635,-3.073; 5 0.635,-3.073; 6 1.905,-3.073; 7 3.175,-3.073; 8 4.445,-3.073; 9 4.445,3.073; 10 3.175,3.073; 11 1.905,3.073; 12 0.635,3.073; 13 -0.635,3.073; 14 -1.905,3.073; 15 -3.175,3.073; 16 -4.445,3.073
SOIC-14 = smd 1.27 x 0.635: 1 -0.762,-0.508; 2 -0.762,-1.778; 3 -0.762,-3.048; 4 -0.762,-4.318; 5 -0.762,-5.588; 6 -0.762,-6.858; 7 -0.762,-8.128; 8 4.826,-8.128; 9 4.826,-6.858; 10 4.826,-5.588; 11 4.826,-4.318; 12 4.826,-3.048; 13 4.826,-1.778; 14 4.826,-0.508
618015330923 = drill 1: 1 4.32,2.54; 2 2.03,2.54; 3 -0.26,2.54; 4 -2.55,2.54; 5 -4.84,2.54; 6 5.46,0; 7 3.17,0; 8 0.88,0; 9 -1.41,0; 10 -3.7,0; 11 4.32,-2.54; 12 2.03,-2.54; 13 -0.26,-2.54; 14 -2.55,-2.54; 15 -4.84,-2.54 | drill 3.2: SHELL -12.5,0; SHELL1 12.5,0
AUDIO-JACK-KIT = drill 1.3 pad 2.184: RING 5,5.1; RSH 5,2.5; SLEEVE 0,0; TIP 5,-5.1; TSH 5,-2.5 | hole 1.2: 0,5; -2.5,5; -2.5,-5; 0,-5; 5,0
JP2 = drill 0.914 long: 1 -2.54,0; 2 0,0; 3 2.54,0
B25P = drill 0.813 octagon: A -2.54,0; E 2.54,0; S 0,2.54
R0603 = smd 1 x 1.1: 1 -0.85,0; 2 0.85,0
NMA = drill 0.813 long: 1 0,6.35; 2 0,3.81; 4 0,-1.27; 5 0,-3.81; 6 0,-6.35
PLATED_HOLE_3.6MM = drill 3.6 pad 5.4: P$1 0,0
22-23-2071 = drill 1 long: 1 -7.62,0; 2 -5.08,0; 3 -2.54,0; 4 0,0; 5 2.54,0; 6 5.08,0; 7 7.62,0

### Placement (x,y rotation side)
C1  7.32,59.97 270 top
C2  11.44,32.87 0 top
C3  19.71,33.94 0 top
C4  62.71,94.41 180 top
C5  59.66,92.28 270 top
C6  54.1,91.44 180 top
C7  44.73,91.44 180 top
C8  26.52,59.97 270 top
C9  62.71,86.03 0 top
C10  59.66,88.16 270 top
C11  54.64,40.61 90 top
C12  40.52,26.95 0 top
C13  46.1,59.97 270 top
C14  10.71,21.67 0 top
C15  47.35,28.83 180 top
C16  34.12,28.27 270 top
C17  25.16,21.66 180 top
C18  18.25,21.67 0 top
C19  27.69,35.77 270 top
C20  47.34,40.22 270 top
GPIO1  2.75,59.2 90 top
IC1  16.17,63.88 90 top
IC2  21.95,40.08 90 top
IC3  11.97,39.5 90 top
IC4  35.6,63.88 90 top
IC5  42.55,31.93 90 top
IC6  56.18,63.88 90 top
IC7  29.83,31.91 90 top
J1  23.09,95.1 180 top
J2  48.31,102.11 270 top
J3  23.09,11.43 0 top
JP1  3.73,20.42 270 top
OFFSET  62.48,41.05 180 top
R1  12.51,50.69 90 top
R2  18.76,50.69 90 top
R3  25.01,50.69 90 top
R4  12.51,54.2 270 top
R5  18.76,54.2 270 top
R6  25.01,54.2 270 top
R7  15.91,87.2 90 top
R8  10.46,50.69 90 top
R9  16.71,50.69 90 top
R10  22.95,50.69 90 top
R11  13.55,87.2 90 top
R12  10.46,54.2 270 top
R13  16.71,54.2 270 top
R14  22.95,54.2 270 top
R15  8.4,50.69 90 top
R16  14.65,50.69 90 top
R17  20.9,50.69 90 top
R18  8.4,54.2 270 top
R19  14.65,54.2 270 top
R20  20.9,54.2 270 top
R21  9.68,46.33 180 top
R22  65.76,92.28 270 top
R23  62.71,91.82 180 top
R24  16.38,46.33 180 top
R25  31.03,20.57 270 top
R26  3.58,29.64 180 top
R27  65.68,88.16 90 top
R28  62.71,88.62 180 top
R29  33.62,20.57 270 top
R30  32.25,50.69 90 top
R31  38.5,50.69 90 top
R32  44.75,50.69 90 top
R33  32.25,54.2 270 top
R34  38.5,54.2 270 top
R35  44.75,54.2 270 top
R36  50.66,22.81 180 top
R37  51.39,41.1 180 top
R38  30.19,50.69 90 top
R39  36.44,50.69 90 top
R40  42.69,50.69 90 top
R41  50.71,26.8 180 top
R42  52.92,34.42 90 top
R43  30.19,54.2 270 top
R44  36.44,54.2 270 top
R45  42.69,54.2 270 top
R46  50.71,28.86 0 top
R47  51.39,38.92 0 top
R48  28.14,50.69 90 top
R49  34.38,50.69 90 top
R50  40.63,50.69 90 top
R51  28.14,54.2 270 top
R52  34.38,54.2 270 top
R53  40.63,54.2 270 top
R54  45.66,22.81 0 top
R55  40.67,36.73 180 top
R56  44,26.8 0 top
R57  42.98,41.05 0 top
R58  43.01,38.92 180 top
R59  44,28.86 180 top
R60  65.8,54.2 270 top
R61  65.8,49.58 270 top
R62  63.74,54.2 270 top
R63  63.66,49.58 270 top
R64  55.31,34.42 270 top
R65  37.09,39.14 180 top
R66  61.68,54.2 270 top
R67  61.61,49.58 270 top
R68  36.86,26.62 180 top
R69  36.86,28.73 0 top
R70  37.09,41.86 0 top
R71  59.63,54.2 270 top
R72  59.55,49.58 270 top
R73  57.57,54.2 270 top
R74  57.49,49.58 270 top
R75  55.51,54.2 270 top
R76  55.43,49.58 270 top
R77  66.45,60.81 270 top
R78  44.65,44.73 0 top
R79  53.45,54.2 270 top
R80  53.38,49.58 270 top
R81  59.63,17.83 180 top
R82  31.17,39.27 0 top
R83  51.4,54.2 270 top
R84  51.32,49.58 270 top
R85  49.34,54.2 270 top
R86  49.26,49.58 270 top
R87  31.17,41.99 180 top
R88  31.22,26.6 0 top
R89  31.2,28.76 180 top
R90  47.28,54.2 270 top
R91  47.21,49.58 270 top
U1  18.29,26.22 270 top
U$1  65.36,103.37 0 top
U$2  65.36,2.93 0 top
U$3  3.13,103.37 0 top
U$4  3.13,2.93 0 top
VEC_OUT1  51.21,12.5 0 top
X_SIZE  62.44,32.16 180 top
Y_SIZE  62.44,23.27 180 top

### Tracks (layer width: path | path; a pad name or v marks a point on that pad's centre or on a via)
+3V3  (via drill 0.33, 0.35)
  Top 0.203: IC4.50 v31.85,63.83 IC4.7 | IC1.50 12.42,63.86 v12.42,63.83 IC1.7 | IC6.35 v59.93,63.83 IC6.22 | IC6.50 v52.43,63.83 IC6.7 | IC1.35 v19.92,63.83 IC1.22 | IC4.35 v39.35,63.83 IC4.22
  Top 0.305: C8.1 26.52,61.65 28.7,63.83 v31.85,63.83 | C1.1 7.32,61.8 9.37,63.86 12.42,63.86 | C13.1 46.1,61.72 48.21,63.83 v52.43,63.83
  Top 0.406: IC3.16 8.95,35 v8.95,33.96 8.95,32.9 8.92,32.87 | IC2.14 18.87,33.95 C3.1 | R24.1 18.21,46.33 v18.52,46.02 | R21.1 11.73,46.33 v12.04,46.02 | R26.1 7.66,32.87 8.92,32.87 | 8.92,32.87 C2.1
  Top 0.508: C3.1 17.05,33.94 v17.03,33.96
  Top 0.61: 8.92,35.03 IC3.16 8.91,35.04 | 18.88,33.96 C3.1
  InnerBottomPWR 0.406: v12.04,46.02 v18.52,46.02
  InnerBottomPWR 0.61: 46.1,63.83 46.1,47.02 47.85,45.26 55.73,45.26 OFFSET.E
  InnerBottomPWR 1.27: 26.55,63.83 v19.92,63.83 v12.42,63.83 8.73,63.83 7.81,64.74 7.81,69.32 6.5,70.63 GPIO1.29 | 26.55,63.83 v31.85,63.83 v39.35,63.83 46.1,63.83 v52.42,63.83 v52.43,63.83 v59.93,63.83 | 26.55,63.83 26.55,47.45 25.13,46.02 v18.52,46.02 17.03,44.54 v17.03,33.96 v8.95,33.96
+5V
  Top 0.813: C17.+ 26.66,25.39 25.83,26.22 U1.1
  InnerBottomPWR 1.27: U1.1 24.64,28.25 23.2,29.69 8.88,29.69 6.44,32.13 6.44,46.99 5.66,47.77 GPIO1.11
+12V_OPAMP
  Top 0.254: IC7.4 34.15,29.15 C16.1 | IC5.4 46.87,30.23 48.2,28.9 C15.1
  Top 0.406: 46.9,31.19 IC5.4 46.87,33.1 | IC7.4 34.15,33.6 34.17,33.63
  Top 0.61: U1.6 11.94,27.73 15.96,31.75 27.24,31.75 29.12,33.63 34.17,33.63 46.34,33.63 46.87,33.1
  Top 0.813: C14.+ 9.21,24.61 10.82,26.22 U1.6
+VREF  (via drill 0.33)
  Top 0.254: C12.1 38.27,26.95 R68.1 37.71,25.77 37.09,25.15 30.94,25.15 30.37,25.71 R88.1 | C12.1 39.63,26.91 39.7,26.85 | v39.78,29.72 39.67,29.61 C12.1 | v40.39,38.71 39.82,38.15 R55.2
  Bottom 0.254: v39.78,29.72 39.78,38.1 v40.39,38.71
-12V_OPAMP  (via drill 0.35)
  Top 0.305: IC5.11 46.87,37.8 47.34,38.27 C20.2
  Top 0.406: 46.87,35.36 IC5.11
  Top 0.508: IC7.11 34.15,35.15 34.1,35.11
  Top 0.61: 46.87,35.36 46.62,35.11 34.1,35.11 27.88,35.11 C19.2 26.29,34.92 v24.73,33.35
  Top 0.813: C18.- 19.75,24.61 18.14,26.22 U1.4
  Bottom 0.61: U1.4 17.02,28.23 19.66,30.86 22.24,30.86 v24.73,33.35
AUDIO_L  (via drill 0.33)
  Top 0.254: R27.1 v65.68,85.8
  InnerTopGND 0.254: GPIO1.2 2.74,36.33 v2.74,43.97 | v6.63,53.57 7.77,54.71 7.77,79.25 6.78,80.24 6.78,84.96 5.33,86.41 5.33,94.49 11.73,100.89 35.28,100.89 44.2,91.97 59.51,91.97 v65.68,85.8
  Bottom 0.254: v2.74,43.97 2.74,51.13 3.2,51.59 4.65,51.59 v6.63,53.57
AUDIO_R  (via drill 0.33)
  Top 0.254: R22.1 v65.76,94.64
  InnerTopGND 0.254: v6.63,52.27 5.72,53.19 5.72,54.03 6.86,55.17 6.86,78.79 5.87,79.78 5.87,84.51 4.42,85.95 4.42,95.02 11.28,101.88 35.66,101.88 44.65,92.89 64.01,92.89 v65.76,94.64
  Bottom 0.254: GPIO1.7 5.79,44.46 5.79,51.44 v6.63,52.27
B1+
  Top 0.254: IC5.8 50.68,36.91 52.24,38.47 R47.2 R37.1
B+  (via drill 0.33)
  Top 0.305: R37.2 v49.17,41.1
  InnerTopGND 0.305: v49.17,41.1 54.18,36.09 54.18,19.66 48.67,14.15 VEC_OUT1.3
DAC1_B0
  Top 0.203: R20.1 17.42,58.52 IC1.17
DAC1_B1  (via drill 0.33)
  Top 0.203: R17.1 v20.9,48.48 | IC1.19 18.42,61.78 v18.15,62.05
  Bottom 0.203: v20.9,48.48 20.9,55.95 18.15,58.7 v18.15,62.05
DAC1_B2
  Top 0.203: R14.1 18.92,59.08 IC1.20
DAC1_B3  (via drill 0.33)
  Top 0.203: R10.1 v22.95,48.48 | IC1.21 19.42,61.77 v19.14,62.05
  Bottom 0.203: v22.95,48.48 22.95,55.57 19.14,59.38 v19.14,62.05
DAC1_B4
  Top 0.254: R6.1 25.01,56.18 24.48,56.71 22.34,56.71 20.42,58.64 IC1.23
DAC1_B5  (via drill 0.33)
  Top 0.2: R3.1 v25.01,48.48
  Top 0.203: v21.43,62.05 20.92,61.54 IC1.24
  Bottom 0.2: 21.43,58.24 25.01,54.66 v25.01,48.48
  Bottom 0.203: v21.43,62.05 21.43,58.24
DAC1_G0
  Top 0.203: R19.1 13.92,55.78 IC1.10
DAC1_G1  (via drill 0.33)
  Top 0.203: R16.1 v14.65,48.48 | IC1.12 14.92,61.93 v14.8,62.05
  Bottom 0.203: v14.65,48.48 14.72,61.97 v14.8,62.05
DAC1_G2
  Top 0.203: R13.1 15.42,56.33 IC1.13
DAC1_G3  (via drill 0.33)
  Top 0.203: R9.1 v16.71,48.48 | v15.94,62.05 15.92,62.03 IC1.14
  Bottom 0.203: v16.71,48.48 16.71,56.1 15.94,56.87 v15.94,62.05
DAC1_G4
  Top 0.203: R5.1 16.42,57.39 IC1.15
DAC1_G5  (via drill 0.33)
  Top 0.2: 18.76,49.17 v18.76,48.48
  Top 0.203: v16.93,62.05 v16.92,62.04 IC1.16 | R2.1 18.76,49.17
  Bottom 0.2: 17.7,57.1 18.76,56.03 v18.76,48.48
  Bottom 0.203: v16.93,62.05 16.93,57.86 17.7,57.1
DAC1_HSYNC
  Top 0.203: IC1.26 21.92,58.93 22.17,58.67 23.24,58.67 24,59.44 24,61.26 26.59,63.86 26.59,72.69 15.91,83.38 R7.1
DAC1_LAT  (via drill 0.33)
  Top 0.203: IC1.56 v9.42,65.43 | IC1.29 v22.92,65.43 | IC2.3 26.16,38.81 v26.9,39.55
  InnerBottomPWR 0.203: v9.42,65.43 v22.92,65.43
  Bottom 0.203: v22.92,65.43 25.91,62.44 25.91,40.54 v26.9,39.55
DAC1_R0
  Top 0.203: R18.1 9.92,56.57 IC1.2
DAC1_R1  (via drill 0.33)
  Top 0.203: R15.1 v8.4,48.48 | v10,62.05 10.42,61.63 IC1.3
  Bottom 0.203: v8.4,48.48 8.4,56.33 10,57.93 v10,62.05
DAC1_R2
  Top 0.203: R12.1 11.42,56.01 IC1.5
DAC1_R3  (via drill 0.33)
  Top 0.203: R8.1 v10.46,48.48 | v11.22,62.12 11.92,61.42 IC1.6
  Bottom 0.203: v10.46,48.48 10.46,56.33 11.22,57.1 v11.22,62.12
DAC1_R4
  Top 0.203: R4.1 12.92,55.46 IC1.8
DAC1_R5  (via drill 0.33)
  Top 0.2: 12.52,49.25 v12.52,48.48
  Top 0.203: R1.1 12.52,49.25 | IC1.9 13.42,61.97 v13.35,62.05
  Bottom 0.2: v13.35,62.05 13.35,57.33 12.52,56.5 v12.52,48.48
DAC1_VSYNC
  Top 0.203: IC1.27 22.42,61.37 25.6,64.55 25.6,71.93 13.55,83.99 R11.1
DAC2_B0
  Top 0.203: R53.1 36.85,58.83 IC4.17
DAC2_B1  (via drill 0.33)
  Top 0.203: R50.1 40.63,48.64 v40.79,48.48 | IC4.19 37.85,61.78 v37.58,62.05
  Bottom 0.203: v40.79,48.48 40.79,55.5 37.58,58.7 v37.58,62.05
DAC2_B2
  Top 0.203: R45.1 42.69,55.04 41.32,56.41 40.63,56.41 38.35,58.69 IC4.20
DAC2_B3  (via drill 0.33)
  Top 0.203: R40.1 v42.69,48.48 | IC4.21 38.85,61.77 v38.58,62.05
  Bottom 0.203: v42.69,48.48 42.69,55.11 38.58,59.23 v38.58,62.05
DAC2_B4
  Top 0.203: R35.1 42.47,57.32 41.47,57.32 39.85,58.94 IC4.23
DAC2_B5  (via drill 0.33)
  Top 0.203: v44.75,48.48 R32.1 | IC4.24 v40.35,62.05
  Bottom 0.203: v44.75,48.48 44.75,54.66 40.35,59.05 v40.35,62.05
DAC2_G0
  Top 0.203: R52.1 33.35,56.08 IC4.10
DAC2_G1  (via drill 0.33)
  Top 0.203: v34.31,62.05 34.35,62 IC4.12 | R49.1 34.38,48.71 v34.61,48.48
  Bottom 0.203: v34.31,62.05 34.38,61.97 34.38,48.71 v34.61,48.48
DAC2_G2
  Top 0.203: R44.1 34.85,56.64 IC4.13
DAC2_G3  (via drill 0.33)
  Top 0.203: R39.1 v36.44,48.48 | v35.38,62.05 35.35,62.03 IC4.14
  Bottom 0.203: v36.44,48.48 36.44,56.1 35.38,57.17 v35.38,62.05
DAC2_G4
  Top 0.203: R34.1 35.85,57.7 IC4.15
DAC2_G5  (via drill 0.33)
  Top 0.2: R31.1 v38.5,48.48
  Top 0.203: v36.37,62.05 36.35,62.04 IC4.16
  Bottom 0.2: 37.43,57.25 38.5,56.18 v38.5,48.48
  Bottom 0.203: 37.43,57.25 36.37,58.31 v36.37,62.05
DAC2_HSYNC  (via drill 0.33)
  Top 0.203: IC4.26 41.35,58.93 41.76,58.52 v43.66,58.52
  Top 0.254: R25.1 v31.03,22.71
  Bottom 0.254: v43.66,58.52 45.64,56.54 45.64,47.78 43.43,45.57 29.79,45.57 28.27,44.04 28.27,25.45 v31.03,22.71
DAC2_LAT  (via drill 0.33)
  Top 0.203: IC4.56 v28.85,65.43 | IC4.29 v42.35,65.51
  Top 0.254: IC2.6 26.91,42.62 v26.94,42.65
  InnerBottomPWR 0.203: v28.85,65.43 42.28,65.43 v42.35,65.51
  Bottom 0.203: v26.94,42.65 26.44,43.14 26.44,63.02 v28.85,65.43
DAC2_R0
  Top 0.203: R51.1 29.35,56.27 IC4.2
DAC2_R1  (via drill 0.33)
  Top 0.203: R48.1 v28.14,48.48 | v28.97,62.05 29.85,61.17 IC4.3
  Bottom 0.203: v28.14,48.48 28.14,56.26 28.97,57.1 v28.97,62.05
DAC2_R2
  Top 0.203: R43.1 30.85,55.71 IC4.5
DAC2_R3  (via drill 0.33)
  Top 0.203: R38.1 v30.19,48.48 | v30.65,62.05 31.35,61.35 IC4.6
  Bottom 0.203: v30.19,48.48 30.19,56.64 30.65,57.1 v30.65,62.05
DAC2_R4
  Top 0.203: R33.1 32.35,55.15 IC4.8
DAC2_R5  (via drill 0.33)
  Top 0.2: R30.1 v32.25,48.41
  Top 0.203: v32.86,62.05 v32.85,62.04 IC4.9
  Bottom 0.2: 32.86,57.48 32.25,56.87 v32.25,48.41
  Bottom 0.203: v32.86,62.05 32.86,57.48
DAC2_VSYNC  (via drill 0.33)
  Top 0.203: IC4.27 41.85,61.07 42.33,61.54 43.54,61.54 v43.66,61.42
  Top 0.254: R29.1 v33.62,22.71
  Bottom 0.254: v33.62,22.71 29.11,27.2 29.11,43.74 30.02,44.65 43.82,44.65 46.25,47.09 46.25,58.83 v43.66,61.42
DAC3_LAT  (via drill 0.33)
  Top 0.203: IC6.56 v49.43,65.43 | IC6.29 v62.93,65.43
  Top 0.254: v27.28,45.03 19.43,45.03 18.87,44.48 IC2.8
  InnerBottomPWR 0.203: v62.93,65.43 v49.43,65.43
  Bottom 0.203: v27.28,45.03 26.97,45.34 26.97,62.03 29.64,64.69 48.69,64.69 v49.43,65.43
DAC_X  (via drill 0.33)
  Top 0.203: R90.2 R85.2 R83.2 R79.2 R75.2 R73.2 R71.2 R66.2 R62.2 R60.2
  Top 0.254: v35.42,32.46 IC7.5 | 67.51,53.34 67.51,58.89 R77.2 | 67.51,53.34 67.51,37.72 66.37,36.58 59.13,36.58 58.29,35.74 v58.29,34.37 | 67.51,53.34 67.5,53.35 R60.2
  Bottom 0.254: v35.42,32.46 40.22,27.66 51.9,27.66 58.29,34.06 v58.29,34.37
DAC_Y  (via drill 0.33)
  Top 0.203: R61.2 R63.2 R67.2 R72.2 R74.2 R76.2 R80.2 R84.2 R86.2 R91.2 46.37,48.73 45.87,48.23 45.87,46.33 45.5,45.96 R78.2
  Top 0.254: v32.9,32.46 32.88,32.44 IC7.3 | v59.55,47.22 R72.2
  Bottom 0.254: v32.9,32.46 32.9,30.64 36.94,26.6 52.12,26.6 62.52,36.99 63.28,36.99 64.01,37.72 64.01,39.78 62.52,41.26 62.52,42.33 59.55,45.3 v59.55,47.22
G1+  (via drill 0.33)
  Top 0.254: IC5.1 43.06,29.18 R59.2
  Top 0.305: IC5.1 43.06,32.39 v43.11,32.44 | v44.82,24.69 44.82,22.81 R54.1
  InnerTopGND 0.305: v44.82,24.69 44.82,30.73 v43.11,32.44
G+  (via drill 0.33)
  Top 0.305: R54.2 46.51,22.05 45.03,20.57 v45.03,17.53
  InnerTopGND 0.305: v45.03,17.53 46.13,16.43 VEC_OUT1.2
GND  (via drill 0.33, 0.35)  (70 unrouted)
  Top 0.203: IC6.4 v50.93,61.95 | IC4.28 43.24,60.09 v43.28,60.05 | IC4.46 v33.85,66.24 | IC4.39 v37.35,66.24 | IC4.32 v40.85,66.24 | IC4.53 v30.35,66.24 | IC1.46 v14.42,66.17 v14.42,66.16 | IC1.32 v21.42,66.17 v21.43,66.16 | IC1.39 v17.92,66.16 | IC1.53 v10.92,66.16 | IC6.53 v50.93,66.24 | IC6.46 v54.43,66.24 | IC6.32 v61.43,66.24 | IC6.39 v57.93,66.24 | IC6.11 54.43,61.55 v54.03,61.95 | IC6.18 57.93,58.99 v57.61,58.67 | IC6.25 61.43,59.12 v61.87,58.67
  Top 0.254: C3.2 21.7,33.94 v21.75,33.88 | R42.1 51.63,33.57 v51.62,33.58 | C12.2 43,26.95 R56.1 | IC3.8 v13.3,43.94 | v13.3,43.94 | IC2.7 v22.94,43.89 | C4.2 v59.66,94.41 C5.1 | C9.1 v59.66,86.03 C10.2
  Top 0.305: C20.1 v45.6,41.07 | C16.2 v34.12,26.14 | C11.2 v54.64,42.9 | C8.2 27.27,59.12 v27.97,59.82 28.24,60.09 IC4.1 | IC1.1 9.42,59.11 v8.92,58.6 8.39,59.12 C1.2 | C13.2 47.56,59.12 v48.08,58.6 | R56.1 v43.15,24.66 | v51.56,24.74 R41.1 | R77.1 v66.45,63.17 | R78.1 42.75,45.78 v42.75,46.56 | R57.1 v40.61,41.05 | IC7.12 32.88,37.6 v33.53,38.25 | IC7.10 35.42,37.58 v34.75,38.25 | C19.1 27.69,37.53 v27.28,37.95
  Top 0.406: C2.2 13.32,32.87 v13.75,32.43
  Top 0.813: U1.5 v14.48,21.67 | C14.- v14.48,21.67 | C18.+ v14.48,21.67 | C17.- 23.66,23.13 22.1,24.69 U1.2
  pour Top: 0,106.6 68.58,106.6 68.58,0 0,0
  pour Bottom: 0,106.6 68.58,106.6 68.58,0 0,0
  pour InnerTopGND: 0,106.6 68.58,106.6 68.58,0 0,0
  pour InnerBottomPWR: 0,106.6 68.58,106.6 68.58,0 0,0
HSYNC  (via drill 0.33)
  Top 0.203: v22.88,71.65 21.92,70.69 IC1.31 | v42.31,71.65 41.35,70.69 IC4.31
  Bottom 0.203: v42.31,71.65 v22.88,71.65 14.33,71.65 6.06,63.37 6.06,60.4 4.88,59.22 2.78,59.22 GPIO1.20
I1+
  Top 0.254: R58.2 42.16,38.39 43.06,37.49 IC5.14 41.55,36.76 R55.1
LATCH_EN_N  (via drill 0.33)
  Top 0.254: IC2.10 21.95,41.35 | 21.95,41.35 IC2.5 | IC2.13 21.95,37.54 | 21.95,37.54 IC2.2 | 21.95,41.35 v21.95,41.3 21.95,37.54 | IC3.10 10.82,42.67 v10.9,42.75 | IC6.1 48.2,60.09 v48.08,59.97 | IC6.28 64.19,60.09 v64.31,59.97
  InnerTopGND 0.254: v10.9,42.75 11.96,41.68 21.56,41.68 v21.95,41.3 23.16,41.3 26.21,44.35 26.21,52.35 28.04,54.18 45.42,54.18 45.95,54.71 45.95,57.84 v48.08,59.97 v64.31,59.97
LED_DISK  (via drill 0.35)
  Top 0.254: 15.02,36.3 IC3.2 12.52,36.32 v12.11,36.74
  Bottom 0.254: GPIO1.3 4.02,37.59 4.04,37.58 9.37,37.58 11.27,37.58 v12.11,36.74
LED_POWER  (via drill 0.35)
  Top 0.254: IC3.3 12.55,37.59 v12.11,38.03
  Bottom 0.254: v12.11,38.03 9.99,40.15 GPIO1.5
LED_USER
  Bottom 0.254: JP1.1 3.73,34.78 GPIO1.1
N$4  (via drill 0.33)
  Top 0.254: C11.1 56.83,39.76 v57.07,40.01
  Top 0.305: IC5.12 v45.6,39.47
  InnerBottomPWR 0.305: v45.6,39.47 46.57,38.51 57.07,38.51 | 57.07,38.51 OFFSET.S | v57.07,40.01 57.07,38.51
N$5  (via drill 0.33)
  Top 0.254: IC3.1 12.5,35.05 v12.04,35.51
  Bottom 0.254: v12.04,35.51 8.53,35.51 7.7,34.67 7.7,22.63 5.49,20.42 JP1.2
N$6
  Top 0.406: J2.RING 53.41,95.4 52.6,94.59 C6.-
N$7
  Top 0.305: C9.2 R28.1 63.79,88.85 65.52,88.85 R27.2
N$8
  Top 0.305: R28.2 61.63,88.85 59.83,88.85 C10.1 50.28,89.01 47.85,91.44 C7.+
N$9
  Top 0.305: C7.- 43.23,97.09 J2.TIP
N$10
  Top 0.305: R22.2 65.6,91.59 63.79,91.59 R23.1 C4.1
N$11
  Top 0.305: R23.2 61.63,91.59 59.83,91.59 C5.2 55.61,91.43 C6.+
N$32  (via drill 0.33)
  Top 0.203: IC3.4 13.29,38.86 v13.19,38.96
  Top 0.254: IC2.1 23.2,36.27 v23.17,36.3
  Bottom 0.254: v13.19,38.96 14.38,37.77 14.53,37.62 15.86,36.3 v23.17,36.3
N$33  (via drill 0.33)
  Top 0.203: IC3.5 13.39,40.13 v13.19,40.33
  Top 0.254: v23.02,38.89 23.02,39.48 23.62,40.08 IC2.4
  Bottom 0.254: v23.02,38.89 21.67,37.54 15.99,37.54 v13.19,40.33
N$40
  Top 0.254: IC3.6 16.41,41.4 17.63,42.62 IC2.9
N$41  (via drill 0.33)
  Top 0.203: IC3.7 12.3,42.67 v12.28,42.7
  Top 0.254: IC2.12 20.81,38.81 v20.89,38.89
  Bottom 0.254: v12.28,42.7 16.14,38.84 20.84,38.84 v20.89,38.89
N$51
  Top 0.254: R68.2 R69.1 36.01,29.48 36.69,30.15 IC7.6
N$52
  Top 0.254: IC7.2 31.61,30.13 32.05,29.68 R89.1 32.05,26.62 R88.2
N$54  (via drill 0.33)
  Top 0.254: IC7.7 37.94,31.13 | IC7.7 37.98,31.17 37.98,32.44 v37.93,32.46 | R65.1 37.96,39.13 v37.96,40.39 | IC7.7 37.96,29.98 37.71,29.73 R69.2
  Bottom 0.406: v37.93,32.46 37.93,37.11 37.93,40.36 v37.96,40.39
N$55  (via drill 0.33, 0.35)
  Top 0.254: IC7.9 36.69,37.77 36.24,38.22 R65.2 R70.1
  Top 0.305: R70.1 36.24,43.27 v36.64,43.67 | v59.51,35.59 59.9,35.2 X_SIZE.E
  Bottom 0.305: v36.64,43.67 36.76,43.79 51.31,43.79 v59.51,35.59
N$57  (via drill 0.35)
  Top 0.254: IC7.13 31.61,37.87 32.02,38.29 R82.2 R87.1 33.13,41.99 v33.28,42.14
  Bottom 0.254: v33.28,42.14 31.61,40.47 31.61,30.28 36.2,25.68 57.49,25.68 Y_SIZE.E
N$58  (via drill 0.33)
  Top 0.254: 30.18,36.73 IC7.14 29.79,36.73 29.03,37.49 29.03,40.7 R87.2 v30.31,43.67
  Top 0.305: v57.16,34.4 57.16,28.87 62.44,23.59 Y_SIZE.S 62.44,19.79 R81.1
  Bottom 0.305: v30.31,43.67 34.67,43.67 35.76,42.57 38.21,42.57 38.59,42.95 50.85,42.95 57.16,36.65 v57.16,34.4
N$59  (via drill 0.33)
  Top 0.254: 38.04,41.89 R70.2 38.3,41.58 v39.28,41.58 39.28,39.51 39.17,39.4 39.17,38.25 37.96,37.04 IC7.8 37.96,36.99
  Top 0.305: R64.1 55.33,35.28 v55.33,36.88
  InnerBottomPWR 0.305: X_SIZE.S 62.44,35.25 60.81,36.88 v55.33,36.88
  Bottom 0.305: v39.28,41.58 39.81,42.11 50.09,42.11 v55.33,36.88
N$60  (via drill 0.33)
  Top 0.203: IC7.1 30.34,32.41 v30.36,32.44
  Top 0.254: R89.2 30.35,31.13 IC7.1 | R82.1 30.36,39.31 v30.36,40.52
  Bottom 0.254: v30.36,40.52 30.36,36.73 v30.36,32.44
N$61
  Top 0.254: IC5.2 44.33,29.38 R59.1 R56.2
N$62
  Top 0.254: R41.2 49.86,28.27 R46.1 49.86,29.76 49.41,30.2 IC5.6
N$63
  Top 0.254: IC5.13 44.33,37.67 43.86,38.14 R58.1 43.84,38.94 R57.2
N$64
  Top 0.254: R47.1 50.54,38.6 49.41,37.47 IC5.9 49.41,35.79 49.93,35.27 R42.2
R1+
  Top 0.254: IC5.7 50.68,30.38 51.56,29.51 R46.2
  Top 0.305: R46.2 52.37,28.86 52.96,28.27 52.96,24.25 R36.1
R+
  Top 0.305: R36.2 49.81,20.4 43.59,14.17 VEC_OUT1.1
SD_CLK
  InnerTopGND 0.254: GPIO1.14 2.79,49 5.41,49 6.1,48.31 6.1,18.59 5.38,17.88 JP1.3
SD_CMD  (via drill 0.33)
  Top 0.254: IC3.15 v10.82,36.32 | R26.2 v2.73,31.38 v2.74,31.39
  Bottom 0.254: GPIO1.8 2.74,41.43 2.74,36.8 | v10.82,36.32 3.23,36.32 2.74,36.8 | 2.74,36.8 v2.74,31.39
SD_DAT0  (via drill 0.33)
  Top 0.203: v63.8,70.74 62.43,69.37 IC6.30
  Bottom 0.203: GPIO1.16 2.75,54.12 5.11,54.12 5.98,54.99 5.98,56.51 7.66,58.19 7.66,62.38 8.19,62.91 16.88,62.91 22.67,68.7 61.77,68.7 v63.8,70.74
SD_DAT1  (via drill 0.33)
  Top 0.203: v62.88,71.65 61.93,70.69 IC6.31
  Bottom 0.203: GPIO1.18 2.73,56.63 5.18,56.63 7.12,58.57 7.12,62.76 8.19,63.83 10.71,63.83 11.77,64.9 18.02,64.9 22.67,69.54 45.3,69.54 | 45.3,69.54 45.31,69.54 | 45.3,69.54 60.78,69.54 v62.88,71.65
SD_DAT2  (via drill 0.33)
  Top 0.254: GPIO1.4 2.74,36.35 5.87,36.35 7.11,37.59 IC3.14 10.46,37.59 10.9,38.02 v10.9,40.84 | R24.2 14.31,45.11 v14.33,45.11
  InnerTopGND 0.254: v10.9,40.84 9.83,41.91 9.83,43.13 11.81,45.11 v14.33,45.11
SD_DAT3
  Top 0.152: 8.89,38.87 IC3.13
  Top 0.254: GPIO1.6 2.76,38.87 6.55,38.87 | 6.55,38.87 8.89,38.87 | 6.55,38.87 6.55,44.06 R21.2
VEC_X0
  Top 0.203: IC6.2 49.93,58.78 47.28,56.13 R90.1
VEC_X1
  Top 0.203: IC6.3 50.43,58.52 49.34,57.43 R85.1
VEC_X2
  Top 0.203: IC6.5 51.43,55.08 R83.1
VEC_X3
  Top 0.203: IC6.6 51.93,57.51 53.45,55.98 R79.1
VEC_X4
  Top 0.203: IC6.8 52.93,58.18 55.51,55.6 R75.1
VEC_X5
  Top 0.203: IC6.9 53.43,58.44 55.82,56.06 56.59,56.06 R73.1
VEC_X6
  Top 0.203: IC6.10 53.93,58.63 56.04,56.51 58.16,56.51 R71.1
VEC_X7
  Top 0.203: IC6.12 54.93,58.32 56.27,56.97 59.76,56.97 R66.1
VEC_X8
  Top 0.203: IC6.13 55.43,58.43 56.43,57.43 61.36,57.43 R62.1
VEC_X9
  Top 0.203: IC6.14 55.93,58.54 56.58,57.89 62.96,57.89 R60.1
VEC_X+
  Top 0.305: R64.2 55.31,15.16 56.29,14.18 VEC_OUT1.6
VEC_Y0  (via drill 0.33)
  Top 0.203: R91.1 v47.21,51.79 | IC6.15 56.43,61.01 v55.36,62.08
  Bottom 0.203: v47.21,51.79 55.36,59.94 v55.36,62.08
VEC_Y1  (via drill 0.33)
  Top 0.203: R86.1 v49.26,51.79 | IC6.16 56.93,61.5 v56.35,62.08
  Bottom 0.203: v49.26,51.79 55.93,58.46 55.93,61.66 v56.35,62.08
VEC_Y2  (via drill 0.33)
  Top 0.203: R84.1 v51.32,51.79 | IC6.17 57.43,61.99 v57.34,62.08
  Bottom 0.203: v51.32,51.79 56.54,57.01 56.54,61.28 v57.34,62.08
VEC_Y3  (via drill 0.33)
  Top 0.203: R80.1 v53.38,51.79 | IC6.19 58.43,61.98 v58.33,62.08
  Bottom 0.203: v58.33,62.08 58.52,61.89 58.52,56.93 v53.38,51.79
VEC_Y4  (via drill 0.33)
  Top 0.203: R76.1 v55.43,51.79 | IC6.20 58.93,61.7 v59.31,62.08
  Bottom 0.203: v55.43,51.79 59.02,55.37 59.02,61.79 v59.31,62.08
VEC_Y5  (via drill 0.33)
  Top 0.203: R74.1 v57.49,51.79 | IC6.21 59.43,59 v59.78,58.65
  Bottom 0.203: v57.49,51.79 59.78,54.08 v59.78,58.65
VEC_Y6  (via drill 0.33)
  Top 0.203: R72.1 v59.55,51.79 | IC6.23 60.43,61.89 v60.62,62.08
  Bottom 0.203: v59.55,51.79 60.5,52.74 60.5,61.96 v60.62,62.08
VEC_Y7  (via drill 0.33)
  Top 0.203: R67.1 v61.61,51.79 | IC6.24 60.93,61.4 v61.61,62.08
  Bottom 0.203: 61.19,61.66 v61.61,62.08 61.04,61.51 61.04,52.36 v61.61,51.79
VEC_Y8  (via drill 0.33)
  Top 0.203: R63.1 v63.66,51.79 | IC6.26 61.93,61.41 v62.6,62.08
  Bottom 0.203: v63.66,51.79 62.6,52.86 v62.6,62.08
VEC_Y9  (via drill 0.33)
  Top 0.203: R61.1 v65.8,51.79 | IC6.27 62.43,60.92 v63.59,62.08
  Bottom 0.203: v63.59,62.08 63.25,61.73 63.25,54.34 v65.8,51.79
VEC_Y+
  Top 0.305: 58.8,17.81 R81.2 58.83,17.78 VEC_OUT1.7
VGA1_B  (via drill 0.33)
  Top 0.203: R20.2 R17.2 R10.2 | R10.2 R3.2 R6.2 | R14.2 R10.2
  Top 0.305: R17.2 20.06,51.54 19.85,51.33 v19.85,47.52
  InnerTopGND 0.305: v19.85,47.52 19.85,54.69 27.16,62 27.16,72.9 23.35,76.71 J1.3
VGA1_G  (via drill 0.33)
  Top 0.203: R19.2 R16.2 R9.2 | R9.2 R2.2 R5.2 | R13.2 R9.2
  Top 0.305: R16.2 13.89,51.54 13.6,51.26 v13.6,47.52
  InnerTopGND 0.305: v13.6,47.52 13.6,50.04 26.1,62.53 26.1,72.29 21.06,77.33 J1.2
VGA1_HSYNC
  Top 0.203: R7.2 15.91,97.37 17.6,99.06 21.93,99.06 J1.13
VGA1_R  (via drill 0.33)
  Top 0.203: R18.2 R15.2 | R15.2 R8.2 | R8.2 R1.2 R4.2 | R12.2 R8.2 | R15.2 7.43,51.54 v6.67,50.78
  InnerTopGND 0.305: J1.1 18.77,77.94 25.03,71.68 25.03,63.14 13.43,51.54 7.43,51.54 v6.67,50.78
VGA1_VSYNC
  Top 0.203: J1.14 23.53,99.75 17.15,99.75 15.09,97.69 15.09,91.9 13.55,90.36 R11.2
VGA2_B  (via drill 0.33, 0.35)
  Top 0.203: R40.2 R50.2 R53.2 | R40.2 R32.2 R35.2 | R45.2 R40.2
  Top 0.254: IC5.10 48.14,35.46 v48.27,35.33
  Top 0.305: R50.2 39.87,51.54 39.59,51.26 v39.59,47.14
  Top 0.406: R50.2 40.5,51.41
  InnerTopGND 0.254: v48.27,35.33 43.47,40.13 43.47,43.26 v39.59,47.14
  InnerTopGND 0.305: v48.27,35.33 49.38,34.22 49.38,22.48 v46.48,19.58
  Bottom 0.305: v46.48,19.58 28.44,19.58 J3.3
VGA2_G  (via drill 0.33)
  Top 0.254: R34.2 R31.2 R39.2 | R39.2 R49.2 R52.2 | R44.2 R39.2 | IC5.3 45.6,32.36 v45.53,32.44
  Top 0.305: R49.2 33.62,51.54 33.34,51.26 v33.34,46.53
  InnerTopGND 0.254: v45.53,32.44 41.95,36.02 41.95,41.27 36.69,46.53 v33.34,46.53
  InnerTopGND 0.305: J3.2 29.59,18.44 41.99,18.44 44.88,21.34 47.24,23.7 47.24,30.72 v45.53,32.44
VGA2_HSYNC
  Top 0.305: J3.13 24.48,7.24 28.88,7.24 31.03,9.38 R25.2
VGA2_R  (via drill 0.33)
  Top 0.203: IC5.5 48.14,32.31 v48.27,32.44
  Top 0.254: R38.2 R30.2 R33.2 | R38.2 R48.2 R51.2 | R43.2 R38.2
  Top 0.305: R48.2 27.3,51.54 26.78,51.03 26.78,48.36 27.62,47.52 v29.15,47.52
  InnerTopGND 0.254: v48.27,32.44 46.67,34.04 42.71,38 42.79,41.73 42.79,42.18 37.44,47.52 v29.15,47.52
  InnerTopGND 0.305: J3.1 30.81,17.37 42.52,17.37 48.27,23.12 v48.27,32.44
VGA2_VSYNC
  Top 0.305: R29.2 33.62,18.62 31.97,16.97 31.97,8.88 29.34,6.25 23.18,6.25 J3.14
VGA_B0  (via drill 0.33)
  Top 0.203: v17.39,77.14 17.42,77.11 IC1.40 | v36.82,77.14 36.85,77.11 IC4.40 | 1.46,60.44 GPIO1.22 2.15,60.47 3.42,61.74 5.26,61.74 6.74,63.22 6.74,68.33 6.06,69.01 v5.83,69.01 | v57.4,77.14 57.43,77.11 IC6.40
  Bottom 0.203: v36.82,77.14 v17.39,77.14 14.33,77.14 6.21,69.01 v5.83,69.01 | 36.87,77.09 v36.82,77.14 | v36.82,77.14 v57.4,77.14 57.45,77.09
VGA_B1  (via drill 0.33, 0.35)
  Top 0.203: v18.31,76.22 18.42,76.11 IC1.38 | v37.74,76.22 37.85,76.11 | 37.85,76.11 IC4.38 | GPIO1.24 2.1,63.01 3.42,64.33 5.26,64.33 5.83,64.9 v5.83,67.87 | 37.86,76.1 37.85,76.11 | v58.31,76.22 58.44,76.1 58.43,76.09 IC6.38
  Bottom 0.203: v37.74,76.22 v18.31,76.22 14.33,76.22 6.06,67.87 v5.83,67.87 | 37.79,76.17 v37.74,76.22 | 58.36,76.17 v58.31,76.22 v37.74,76.22
VGA_B2  (via drill 0.33)
  Top 0.203: v19.22,75.31 18.92,75.01 IC1.37 | v38.65,75.31 38.35,75.01 IC4.37 | 59.23,75.4 v59.23,75.31 58.93,75.01 IC6.37
  Bottom 0.203: GPIO1.26 2.78,66.84 6.02,66.84 14.49,75.31 v19.22,75.31 v38.65,75.31 v59.23,75.31
VGA_B3  (via drill 0.33)
  Top 0.203: v20.14,74.39 19.42,73.68 IC1.36 | v39.57,74.39 38.85,73.68 IC4.36 | v60.14,74.39 59.43,73.68 IC6.36
  Bottom 0.203: GPIO1.25 5.57,65.55 14.41,74.39 v20.14,74.39 v39.57,74.39 v60.14,74.39
VGA_B4  (via drill 0.33)
  Top 0.203: v21.05,73.48 20.42,72.85 IC1.34 | v40.48,73.48 39.85,72.85 IC4.34 | 61.18,73.35 v61.05,73.48 60.43,72.85 IC6.34
  Bottom 0.203: v61.05,73.48 v40.48,73.48 v21.05,73.48 14.49,73.48 GPIO1.23
VGA_B5  (via drill 0.33)
  Top 0.203: v21.96,72.56 20.92,71.52 IC1.33 | v41.39,72.56 40.35,71.52 IC4.33 | v61.97,72.56 60.93,71.52 IC6.33
  Bottom 0.203: v61.97,72.56 v41.39,72.56 v21.96,72.56 14.41,72.56 5.52,63.68 5.52,61.97 GPIO1.21
VGA_G0  (via drill 0.33)
  Top 0.203: v11.91,82.62 11.91,76.68 13.92,74.66 IC1.47 | v31.34,82.62 31.34,76.37 33.35,74.36 IC4.47 | v51.91,82.62 51.91,76.37 53.93,74.36 IC6.47
  Bottom 0.203: GPIO1.39 5.68,83.33 6.39,82.62 v11.91,82.62 v31.34,82.62 v51.91,82.62
VGA_G1  (via drill 0.33)
  Top 0.203: v12.82,81.71 12.82,76.6 14.92,74.5 IC1.45 | v32.25,81.71 32.25,76.45 34.35,74.35 IC4.45 | v52.82,81.71 52.82,76.45 54.93,74.35 IC6.45
  Bottom 0.203: GPIO1.37 4.94,81.71 v12.82,81.71 v32.25,81.71 v52.82,81.71
VGA_G2  (via drill 0.33)
  Top 0.203: v13.73,80.79 13.73,76.6 15.42,74.91 IC1.44 | v33.17,80.79 33.17,76.53 34.85,74.84 IC4.44 | v53.74,80.79 53.74,76.53 55.43,74.84 IC6.44
  Bottom 0.203: GPIO1.35 6.99,78.25 9.53,80.79 v13.73,80.79 v33.17,80.79 v53.74,80.79
VGA_G3  (via drill 0.33)
  Top 0.203: v14.65,79.88 14.65,76.68 15.92,75.4 IC1.43 | v34.08,79.88 34.08,76.6 35.35,75.33 IC4.43 | v54.65,79.88 54.65,76.6 55.93,75.33 IC6.43
  Bottom 0.203: v54.65,79.88 v34.08,79.88 v14.65,79.88 9.69,79.96 6.59,76.86 5.18,76.86 GPIO1.33
VGA_G4  (via drill 0.33)
  Top 0.203: v15.56,78.96 15.56,76.75 16.42,75.9 IC1.42 | v34.99,78.96 34.99,76.68 35.85,75.82 IC4.42 | v55.57,78.96 55.57,76.68 56.43,75.82 IC6.42
  Bottom 0.203: v55.57,78.96 v34.99,78.96 v15.56,78.96 12.66,78.96 7.07,73.38 4.24,73.38 GPIO1.31
VGA_G5  (via drill 0.33)
  Top 0.203: v16.48,78.05 16.48,76.83 16.92,76.39 IC1.41 | v35.91,78.05 35.91,76.75 36.35,76.31 IC4.41 | v56.48,78.05 56.48,76.75 56.93,76.31 IC6.41
  Bottom 0.203: v56.48,78.05 v35.91,78.05 v16.48,78.05 14.41,78.05 6.29,69.93 5.52,69.93 4.02,68.43 GPIO1.27
VGA_R0  (via drill 0.33)
  Top 0.203: IC1.55 9.92,72.79 6.42,76.3 v6.42,88.11 | IC4.55 29.35,72.41 25.85,75.92 v25.85,88.11 | v46.42,88.11 46.42,75.92 49.93,72.41 IC6.55
  Bottom 0.203: v46.42,88.11 v25.85,88.11 v6.42,88.11 3.96,85.65 2.97,85.65 1.48,84.16 GPIO1.40
VGA_R1  (via drill 0.33)
  Top 0.203: IC1.54 10.42,73.21 7.33,76.3 v7.33,87.19 | IC4.54 29.85,72.9 26.76,75.99 v26.76,87.19 | v47.34,87.19 47.34,75.99 50.43,72.9 IC6.54
  Bottom 0.203: GPIO1.38 2.78,82.08 2.78,83.95 3.77,84.94 5.08,84.94 v7.33,87.19 v26.76,87.19 v47.34,87.19
VGA_R2  (via drill 0.33, 0.35)
  Top 0.203: IC1.52 11.42,73.05 8.25,76.22 v8.25,80.82 v8.25,86.28 | IC4.52 30.85,72.89 27.68,76.07 v27.68,86.28 | v48.25,86.28 48.25,76.07 51.43,72.89 IC6.52
  Bottom 0.203: v8.25,86.28 v27.68,86.28 v48.25,86.28 | GPIO1.36 2.76,79.53 6.95,79.53 v8.25,80.82
VGA_R3  (via drill 0.33, 0.35)
  Top 0.203: IC1.51 11.92,73.46 9.16,76.22 v9.16,76.86 v9.16,85.37 | IC4.51 31.35,73.38 28.59,76.15 v28.59,85.37 | v49.17,85.37 49.17,76.15 51.93,73.38 IC6.51
  Bottom 0.203: v9.16,85.37 v28.59,85.37 v49.17,85.37 | GPIO1.34 2.77,74.42 6.72,74.42 v9.16,76.86
VGA_R4  (via drill 0.33, 0.35)
  Top 0.203: v29.51,84.45 29.51,76.22 32.35,73.38 IC4.49 | GPIO1.32 2.05,73.17 3.34,74.46 4.95,74.46 v5.9,75.41 | IC1.49 12.92,73.38 10.08,76.22 v10.08,78.99 v10.08,84.45 | v50.08,84.45 50.08,76.22 52.93,73.38 IC6.49
  Bottom 0.203: v10.08,84.45 v29.51,84.45 v50.08,84.45 | v5.9,75.41 6.5,75.41 v10.08,78.99
VGA_R5  (via drill 0.33, 0.35)
  Top 0.203: v30.42,83.54 30.42,76.3 32.85,73.87 IC4.48 | IC1.48 13.42,74.07 v11.24,76.25 10.99,76.5 v10.99,83.54 | v51,83.54 51,76.3 53.43,73.87 IC6.48 | GPIO1.28 2.78,69.38 2.78,71.37 3.24,71.83 5.52,71.83 v5.98,72.29
  Bottom 0.203: v10.99,83.54 v30.42,83.54 v51,83.54 | v5.98,72.29 7.28,72.29 v11.24,76.25
VSYNC  (via drill 0.33)
  Top 0.203: v23.79,70.74 22.42,69.37 IC1.30 | v43.22,70.74 41.85,69.37 IC4.30
  Bottom 0.203: v43.22,70.74 v23.79,70.74 16.7,70.74 10.48,64.52 8.04,64.52 6.59,63.07 6.59,60.02 4.5,57.93 GPIO1.19

### Text on the board
tPlace: 0V to +5V | R | G | B | X | Y | GND | MiSTer Vector + Dual VGA | ElectronAsh Oct 2022
Muster: USB | ISP | PWR | USB | ISP | PWR | USB | ISP | PWR | USB | ISP | PWR